# EAGLE design Actuator-MKI-Revision-DT (EAGLE 9.6.2)

## Sheet 1 of 2: Part Schematics
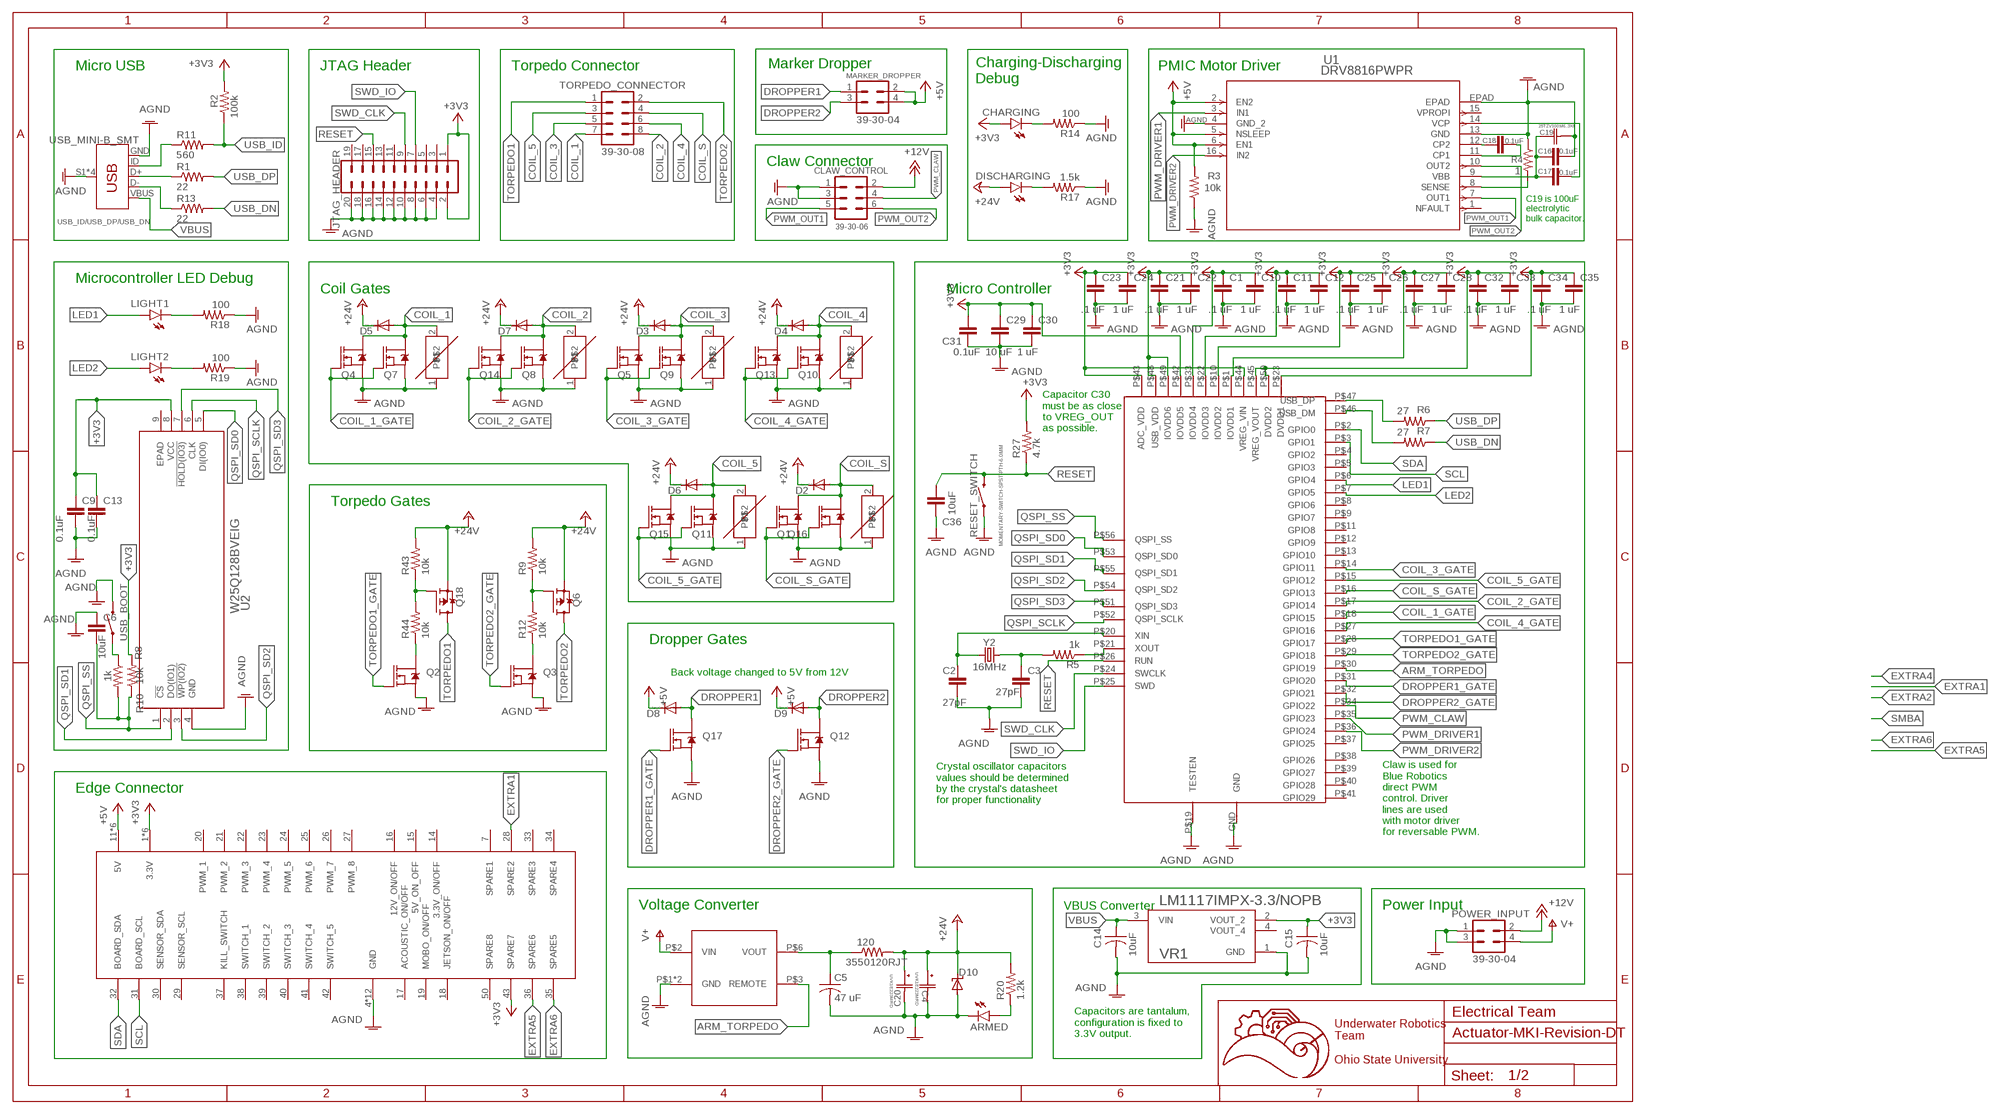
[diagram p0: schematic, sheet 1]

### Parts
120  3550120RJT  [3550120RJT]
ARMED  LEDCHIPLED_0603  [CHIPLED_0603]
C1  .1 uF  C-EUC0603  [C0603]
C2  27pF  C-EUC0603  [C0603]
C3  27pF  C-EUC0603  [C0603]
C4  UVK1E223MRD  [CAP_UFW_25X50_NCH]
C5  47 uF  C-USC1206K  [C1206K]
C6  10uF  C-EUC0603  [C0603]
C9  0.1uF  C-EUC0603  [C0603]
C10  1 uF  C-EUC0603  [C0603]
C11  .1 uF  C-EUC0603  [C0603]
C12  1 uF  C-EUC0603  [C0603]
C13  0.1uF  C-EUC0603  [C0603]
C14  10uF  C-USC0603  [C0603]
C15  10uF  C-USC0603  [C0603]
C16  0.1uF  C-EUC0603  [C0603]
C17  0.1uF  C-EUC0603  [C0603]
C18  0.1uF  C-EUC0603  [C0603]
C19  25TZV100M6.3X8  [CAP_J-V_6P3X8_RUB]
C20  UVK1E223MRD  [CAP_UFW_25X50_NCH]
C21  .1 uF  C-EUC0603  [C0603]
C22  1 uF  C-EUC0603  [C0603]
C23  .1 uF  C-EUC0603  [C0603]
C24  1 uF  C-EUC0603  [C0603]
C25  .1 uF  C-EUC0603  [C0603]
C26  1 uF  C-EUC0603  [C0603]
C27  .1 uF  C-EUC0603  [C0603]
C28  1 uF  C-EUC0603  [C0603]
C29  10 uF  C-EUC0603  [C0603]
C30  1 uF  C-EUC0603  [C0603]
C31  0.1uF  C-EUC0603  [C0603]
C32  .1 uF  C-EUC0603  [C0603]
C33  1 uF  C-EUC0603  [C0603]
C34  .1 uF  C-EUC0603  [C0603]
C35  1 uF  C-EUC0603  [C0603]
C36  10uF  C-EUC0603  [C0603]
CHARGING  LEDCHIPLED_0603  [CHIPLED_0603]
CLAW_CONTROL  39-30-06  [39-30-?06?]
D2  DIODE-SMB  [SMB]
D3  DIODE-SMB  [SMB]
D4  DIODE-SMB  [SMB]
D5  DIODE-SMB  [SMB]
D6  DIODE-SMB  [SMB]
D7  DIODE-SMB  [SMB]
D8  DIODE-SMB  [SMB]
D9  DIODE-SMB  [SMB]
D10  SUPPRESSOR-SMBJ  [SMBJ]
DISCHARGING  LEDCHIPLED_0603  [CHIPLED_0603]
JTAG_HEADER  CONN_10X2  [2X10]
LIGHT1  LEDCHIPLED_0603  [CHIPLED_0603]
LIGHT2  LEDCHIPLED_0603  [CHIPLED_0603]
MARKER_DROPPER  39-30-04  [39-30-?04?]
POWER_INPUT  39-30-04  [39-30-?04?]
Q1  MOSFET-NCH-AO3404A  [SOT23-3]
Q2  MOSFET-NCH-AO3404A  [SOT23-3]
Q3  MOSFET-NCH-AO3404A  [SOT23-3]
Q4  MOSFET-NCH-AO3404A  [SOT23-3]
Q5  MOSFET-NCH-AO3404A  [SOT23-3]
Q6  FDD4141TO252  [TO252]
Q7  MOSFET-NCH-AO3404A  [SOT23-3]
Q8  MOSFET-NCH-AO3404A  [SOT23-3]
Q9  MOSFET-NCH-AO3404A  [SOT23-3]
Q10  MOSFET-NCH-AO3404A  [SOT23-3]
Q11  MOSFET-NCH-AO3404A  [SOT23-3]
Q12  MOSFET-NCH-AO3404A  [SOT23-3]
Q13  MOSFET-NCH-AO3404A  [SOT23-3]
Q14  MOSFET-NCH-AO3404A  [SOT23-3]
Q15  MOSFET-NCH-AO3404A  [SOT23-3]
Q16  MOSFET-NCH-AO3404A  [SOT23-3]
Q17  MOSFET-NCH-AO3404A  [SOT23-3]
Q18  FDD4141TO252  [TO252]
R1  22  R-US_R0603  [R0603]
R2  100k  R-US_R0603  [R0603]
R3  10k  R-US_R0603  [R0603]
R4  1  R-US_R0805  [R0805]
R5  1k  R-US_R0603  [R0603]
R6  27  R-US_R0603  [R0603]
R7  27  R-US_R0603  [R0603]
R8  10k  R-US_R0603  [R0603]
R9  10k  R-US_R0603  [R0603]
R10  1k  R-US_R0603  [R0603]
R11  560  R-US_R0603  [R0603]
R12  10k  R-US_R0603  [R0603]
R13  22  R-US_R0603  [R0603]
R14  100  R-US_R0805  [R0805]
R17  1.5k  R-US_R0805  [R0805]
R18  100  R-US_R0805  [R0805]
R19  100  R-US_R0805  [R0805]
R20  1.2k  R-US_R0805  [R0805]
R27  4.7k  R-US_R0603  [R0603]
R43  10k  R-US_R0603  [R0603]
R44  10k  R-US_R0603  [R0603]
RESET_SWITCH  MOMENTARY-SWITCH-SPST-PTH-6.0MM  [TACTILE_SWITCH_PTH_6.0MM]
TORPEDO_CONNECTOR  39-30-08  [39-30-?08?]
U1  DRV8816PWPR  [PWP_16]
U2  W25Q128BVEIG  [WIN_E-8_WIN]
U$1  5530843-EDGE  [5530843-6-BOARDFINGERS]
U$2  ERZ-VF2M270ERZ-VF2M270  [RESM8060X320N]
U$3  ERZ-VF2M270ERZ-VF2M270  [RESM8060X320N]
U$4  ERZ-VF2M270ERZ-VF2M270  [RESM8060X320N]
U$5  ERZ-VF2M270ERZ-VF2M270  [RESM8060X320N]
U$6  TMR6-2415  [TMR6-2415]
U$7  ERZ-VF2M270ERZ-VF2M270  [RESM8060X320N]
U$8  ERZ-VF2M270ERZ-VF2M270  [RESM8060X320N]
U$9  RP2040  [RP2040]
USB_BOOT  MOMENTARY-SWITCH-SPST-PTH-6.0MM  [TACTILE_SWITCH_PTH_6.0MM]
USB_ID/USB_DP/USB_DN  USB_MINI-B_SMT  [USB-MINIB]
VR1  LM1117IMPX-3.3/NOPB  [VREG_LM1117IMPX-3.3/NOPB]
Y2  16MHz  CRYSTAL-16MHZPTH-HC49US  [HC49US]

### Nets
+3V3: C1.1 C9.1 C10.1 C11.1 C12.1 C13.1 C15.1 C21.1 C22.1 C23.1 C24.1 C25.1 C26.1 C27.1 C28.1 C29.1 C30.1 C31.2 C32.1 C33.1 C34.1 C35.1 CHARGING.A JTAG_HEADER.1 JTAG_HEADER.2 R2.2 R8.2 R27.2 U2.8(VCC) U$1.1(3.3V) U$1.2(3.3V) U$1.3(3.3V) U$1.43(SPARE7) U$1.54(3.3V) U$1.55(3.3V) U$1.56(3.3V) U$9.P$1(IOVDD1) U$9.P$10(IOVDD2) U$9.P$22(IOVDD3) U$9.P$23(DVDD1) U$9.P$33(IOVDD4) U$9.P$42(IOVDD5) U$9.P$43(ADC_VDD) U$9.P$44(VREG_VIN) U$9.P$45(VREG_VOUT) U$9.P$48(USB_VDD) U$9.P$49(IOVDD6) U$9.P$50(DVDD2) VR1.2(VOUT_2)
+5V: D8.C D9.C MARKER_DROPPER.2 MARKER_DROPPER.4 R3.2 U1.2(EN2) U1.5(NSLEEP) U1.6(EN1) U$1.11(5V) U$1.12(5V) U$1.13(5V) U$1.44(5V) U$1.45(5V) U$1.46(5V)
+12V: CLAW_CONTROL.2 POWER_INPUT.2
+24V: 120.P$2 C4.1 C20.1 D2.C D3.C D4.C D5.C D6.C D7.C D10.C DISCHARGING.A Q6.2(S) Q18.2(S) R9.2 R20.2 R43.2
AGND: ARMED.C C1.2 C2.2 C3.2 C4.2 C5.2 C6.1 C9.2 C10.2 C11.2 C12.2 C13.2 C14.2 C15.2 C16.2 C19.2 C20.2 C21.2 C22.2 C23.2 C24.2 C25.2 C26.2 C27.2 C28.2 C29.2 C30.2 C31.1 C32.2 C33.2 C34.2 C35.2 C36.1 CLAW_CONTROL.1 CLAW_CONTROL.3 D10.A JTAG_HEADER.4 JTAG_HEADER.6 JTAG_HEADER.8 JTAG_HEADER.10 JTAG_HEADER.12 JTAG_HEADER.14 JTAG_HEADER.16 JTAG_HEADER.18 JTAG_HEADER.20 POWER_INPUT.1 POWER_INPUT.3 Q1.2(S) Q2.2(S) Q3.2(S) Q4.2(S) Q5.2(S) Q7.2(S) Q8.2(S) Q9.2(S) Q10.2(S) Q11.2(S) Q12.2(S) Q13.2(S) Q14.2(S) Q15.2(S) Q16.2(S) Q17.2(S) R3.1 R4.1 R14.1 R17.1 R18.1 R19.1 RESET_SWITCH.1 U1.4(GND_2) U1.13(GND) U1.EPAD U2.4(GND) U$1.4(GND) U$1.5(GND) U$1.6(GND) U$1.8(GND) U$1.9(GND) U$1.10(GND) U$1.47(GND) U$1.48(GND) U$1.49(GND) U$1.51(GND) U$1.52(GND) U$1.53(GND) U$2.1 U$3.1 U$4.1 U$5.1 U$6.P$1(GND) U$6.P$7(GND) U$7.1 U$8.1 U$9.GND U$9.P$19(TESTEN) USB_BOOT.3 USB_ID/USB_DP/USB_DN.GND USB_ID/USB_DP/USB_DN.S1(SHIELD) USB_ID/USB_DP/USB_DN.S2(SHIELD) USB_ID/USB_DP/USB_DN.S3(SHIELD) USB_ID/USB_DP/USB_DN.S4(SHIELD) VR1.1(GND)
ARM_TORPEDO: U$6.P$3(REMOTE) U$9.P$30(GPIO19)
COIL_1: D5.A Q4.3(D) Q7.3(D) TORPEDO_CONNECTOR.7 U$8.2
COIL_1_GATE: Q4.1(G) Q7.1(G) U$9.P$18(GPIO15)
COIL_2: D7.A Q8.3(D) Q14.3(D) TORPEDO_CONNECTOR.8 U$7.2
COIL_2_GATE: Q8.1(G) Q14.1(G) U$9.P$17(GPIO14)
COIL_3: D3.A Q5.3(D) Q9.3(D) TORPEDO_CONNECTOR.5 U$5.2
COIL_3_GATE: Q5.1(G) Q9.1(G) U$9.P$14(GPIO11)
COIL_4: D4.A Q10.3(D) Q13.3(D) TORPEDO_CONNECTOR.6 U$4.2
COIL_4_GATE: Q10.1(G) Q13.1(G) U$9.P$27(GPIO16)
COIL_5: D6.A Q11.3(D) Q15.3(D) TORPEDO_CONNECTOR.3 U$3.2
COIL_5_GATE: Q11.1(G) Q15.1(G) U$9.P$15(GPIO12)
COIL_S: D2.A Q1.3(D) Q16.3(D) TORPEDO_CONNECTOR.4 U$2.2
COIL_S_GATE: Q1.1(G) Q16.1(G) U$9.P$16(GPIO13)
DROPPER1: D8.A MARKER_DROPPER.1 Q17.3(D)
DROPPER1_GATE: Q17.1(G) U$9.P$31(GPIO20)
DROPPER2: D9.A MARKER_DROPPER.3 Q12.3(D)
DROPPER2_GATE: Q12.1(G) U$9.P$32(GPIO21)
EXTRA1: U$1.28(SPARE2)
EXTRA5: U$1.36(SPARE6)
EXTRA6: U$1.35(SPARE5)
LED1: LIGHT1.A U$9.P$6(GPIO4)
LED2: LIGHT2.A U$9.P$7(GPIO5)
N$2: C3.1 R5.2 Y2.2
N$3: R5.1 U$9.P$21(XOUT)
N$4: CHARGING.C R14.2
N$6: R11.1 USB_ID/USB_DP/USB_DN.ID
N$7: R1.1 USB_ID/USB_DP/USB_DN.D+
N$8: R13.1 USB_ID/USB_DP/USB_DN.D-
N$10: ARMED.A R20.1
N$11: C2.1 U$9.P$20(XIN) Y2.1
N$12: R6.2 U$9.P$47(USB_DP)
N$15: DISCHARGING.C R17.2
N$16: LIGHT1.C R18.2
N$17: LIGHT2.C R19.2
N$18: R10.1 USB_BOOT.1
N$26: 120.P$1 C5.1 U$6.P$6(VOUT)
N$29: R7.2 U$9.P$46(USB_DM)
N$33: Q18.1(G) R43.1 R44.2
N$34: Q2.3(D) R44.1
N$35: Q6.1(G) R9.1 R12.2
N$36: Q3.3(D) R12.1
N$45: R4.2 U1.8(SENSE)
N$46: C17.2 U1.14(VCP)
N$47: C16.1 C17.1 C19.1 U1.9(VBB)
N$48: C18.2 U1.11(CP1)
N$49: C18.1 U1.12(CP2)
PWM_CLAW: CLAW_CONTROL.4 U$9.P$34(GPIO22)
PWM_DRIVER1: U1.3(IN1) U$9.P$35(GPIO23)
PWM_DRIVER2: U1.16(IN2) U$9.P$36(GPIO24)
PWM_OUT1: CLAW_CONTROL.5 U1.7(OUT1)
PWM_OUT2: CLAW_CONTROL.6 U1.10(OUT2)
QSPI_SCLK: U2.6(CLK) U$9.P$52(QSPI_SCLK)
QSPI_SD0: U2.5(DI(IO0)) U$9.P$53(QSPI_SD0)
QSPI_SD1: U2.2(DO(IO1)) U$9.P$55(QSPI_SD1)
QSPI_SD2: U2.3(!WP(IO2)) U$9.P$54(QSPI_SD2)
QSPI_SD3: U2.7(!HOLD(IO3)) U$9.P$51(QSPI_SD3)
QSPI_SS: C6.2 R8.1 R10.2 U2.1(!CS) U$9.P$56(QSPI_SS)
RESET: C36.2 JTAG_HEADER.15 R27.1 RESET_SWITCH.3 U$9.P$26(RUN)
SCL: U$1.31(BOARD_SCL) U$9.P$3(GPIO1)
SDA: U$1.32(BOARD_SDA) U$9.P$2(GPIO0)
SWD_CLK: JTAG_HEADER.9 U$9.P$24(SWCLK)
SWD_IO: JTAG_HEADER.7 U$9.P$25(SWD)
TORPEDO1: Q18.3(D) TORPEDO_CONNECTOR.1
TORPEDO1_GATE: Q2.1(G) U$9.P$28(GPIO17)
TORPEDO2: Q6.3(D) TORPEDO_CONNECTOR.2
TORPEDO2_GATE: Q3.1(G) U$9.P$29(GPIO18)
USB_DN: R7.1 R13.2
USB_DP: R1.2 R6.1
USB_ID: R2.1 R11.2
V+: POWER_INPUT.4 U$6.P$2(VIN)
VBUS: C14.1 USB_ID/USB_DP/USB_DN.VBUS VR1.3(VIN)
Unconnected: JTAG_HEADER.3 JTAG_HEADER.5 JTAG_HEADER.11 JTAG_HEADER.13 JTAG_HEADER.17 JTAG_HEADER.19 U1.1(NFAULT) U1.15(VPROPI) U2.9(EPAD) U$1.7(SPARE1) U$1.14(3.3V_ON/OFF) U$1.15(5V_ON_OFF) U$1.16(12V_ON/OFF) U$1.17(ACOUSTIC_ON/OFF) U$1.18(JETSON_ON/OFF) U$1.19(MOBO_ON/OFF) U$1.20(PWM_1) U$1.21(PWM_2) U$1.22(PWM_3) U$1.23(PWM_4) U$1.24(PWM_5) U$1.25(PWM_6) U$1.26(PWM_7) U$1.27(PWM_8) U$1.29(SENSOR_SCL) U$1.30(SENSOR_SDA) U$1.33(SPARE3) U$1.34(SPARE4) U$1.37(KILL_SWITCH) U$1.38(SWITCH_1) U$1.39(SWITCH_2) U$1.40(SWITCH_3) U$1.41(SWITCH_4) U$1.42(SWITCH_5) U$1.50(SPARE8) U$9.P$4(GPIO2) U$9.P$5(GPIO3) U$9.P$8(GPIO6) U$9.P$9(GPIO7) U$9.P$11(GPIO8) U$9.P$12(GPIO9) U$9.P$13(GPIO10) U$9.P$37(GPIO25) U$9.P$38(GPIO26) U$9.P$39(GPIO27) U$9.P$40(GPIO28) U$9.P$41(GPIO29) VR1.4(VOUT_4)

### Notes on the sheet
- Micro USB | JTAG Header | Torpedo Connector | Marker Dropper | PMIC Motor Driver
- Charging-Discharging 
  Debug
- Claw Connector
- C19 is 100uF
  electrolytic
  bulk capacitor.
- Microcontroller LED Debug
- Coil Gates | Micro Controller
- Capacitor C30 
  must be as close 
  to VREG_OUT
  as possible.
- Torpedo Gates
- Dropper Gates
- Back voltage changed to 5V from 12V
- Edge Connector
- Crystal oscillator capacitors
  values should be determined
  by the crystal's datasheet
  for proper functionality
- Claw is used for
  Blue Robotics
  direct PWM
  control. Driver
  lines are used
  with motor driver
  for reversable PWM.
- Voltage Converter | VBUS Converter | Power Input
- Electrical Team
- Capacitors are tantalum, 
  configuration is fixed to 
  3.3V output.
- Underwater Robotics
  Team
  
  Ohio State University

## Sheet 2 of 2: Notes
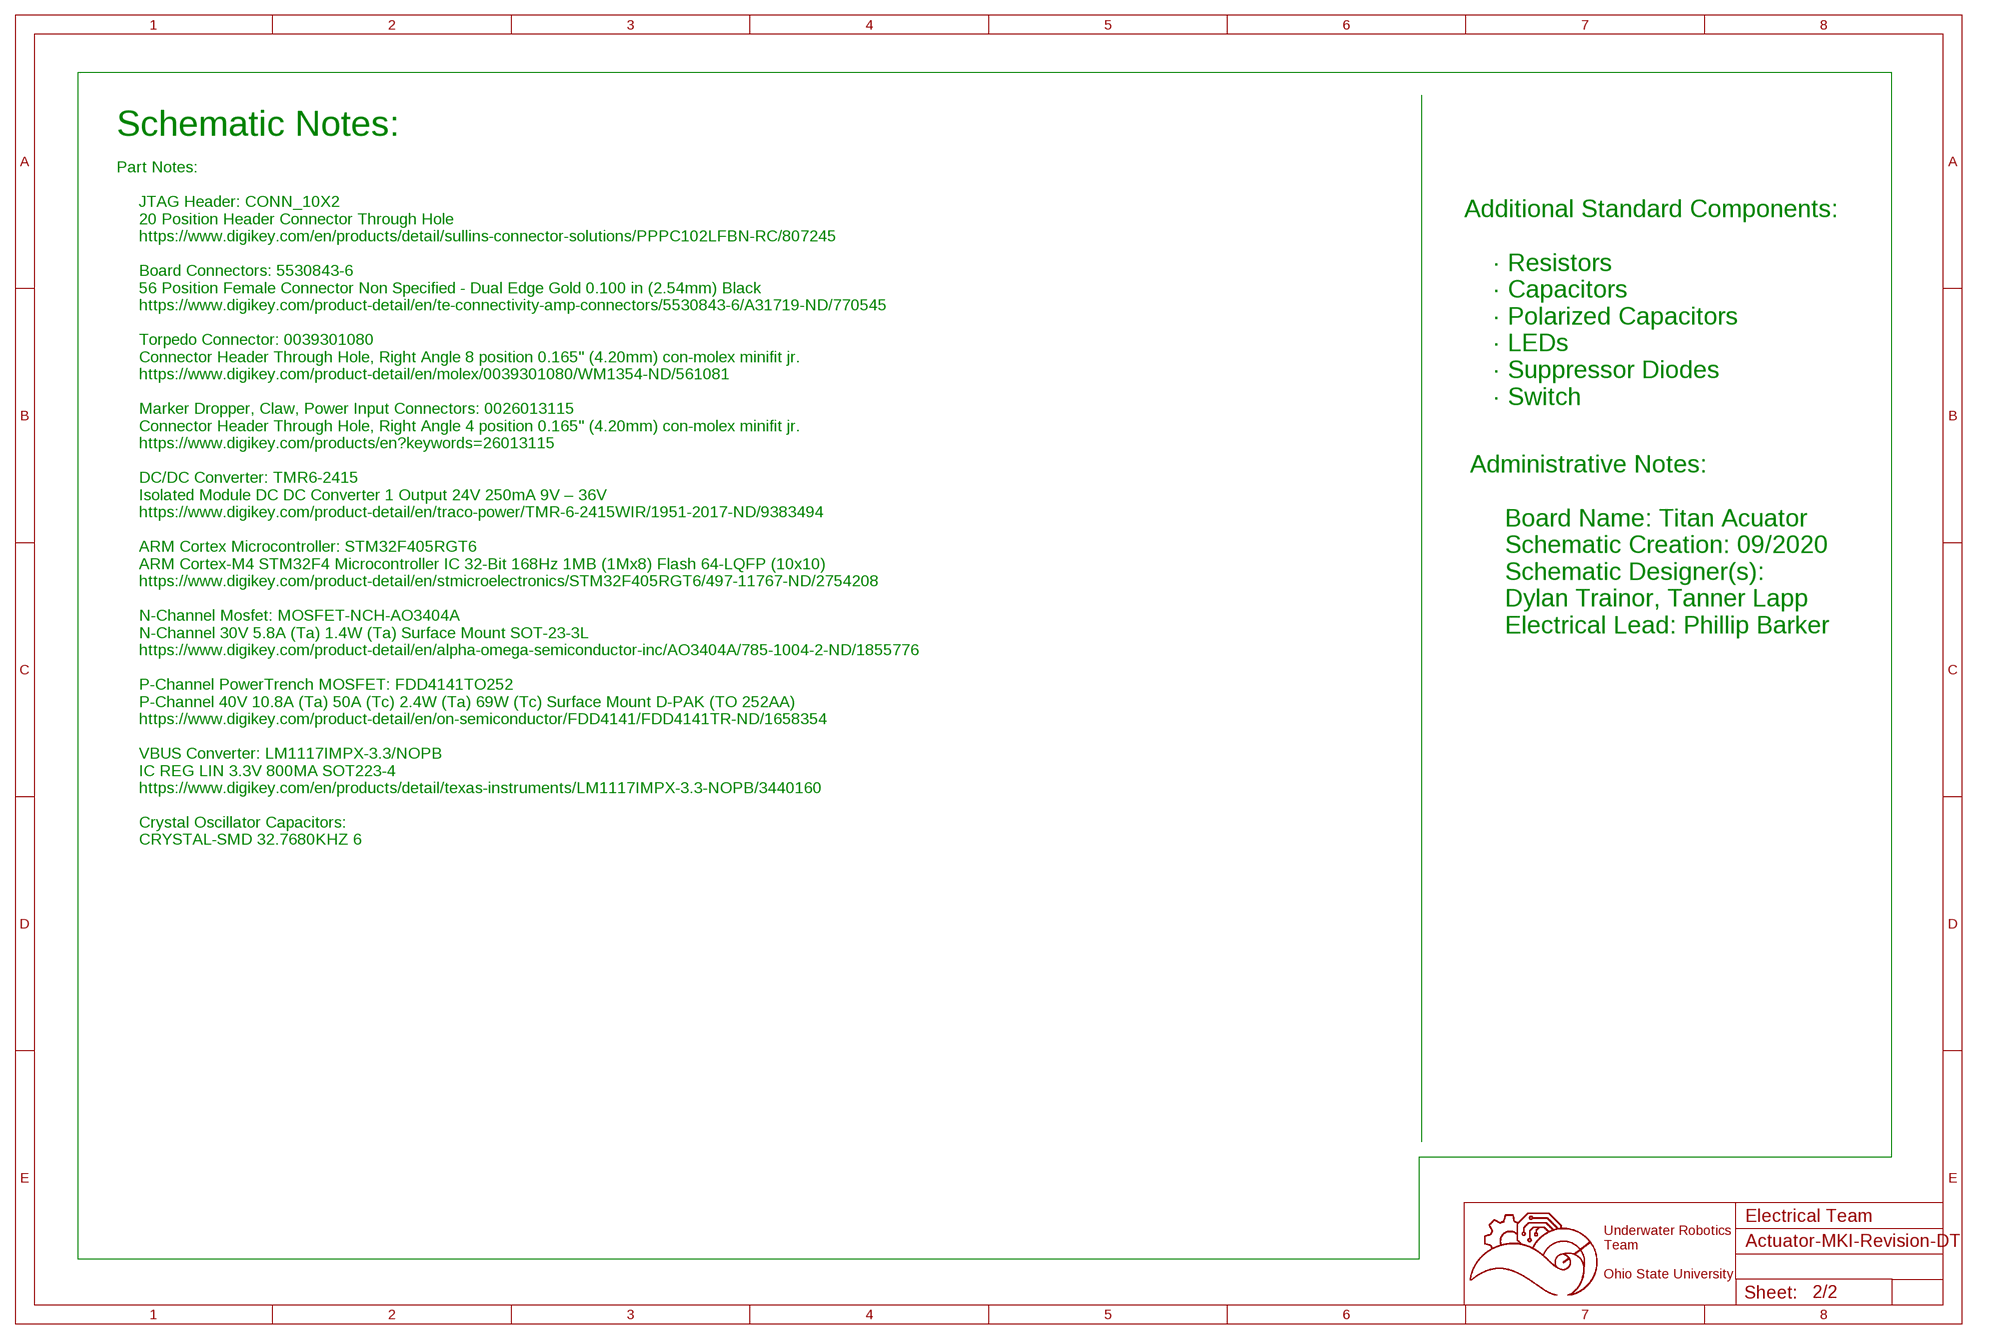
[diagram p1: schematic, sheet 2]

### Notes on the sheet
- Schematic Notes:
- Part Notes:
  
       JTAG Header: CONN_10X2
       20 Position Header Connector Through Hole 
       https://www.digikey.com/en/products/detail/sullins-connector-solutions/PPPC102LFBN-RC/807245
    
       Board Connectors: 5530843-6 
       56 Position Female Connector Non Specified - Dual Edge Gold 0.100 in (2.54mm) Black 
       https://www.digikey.com/product-detail/en/te-connectivity-amp-connectors/5530843-6/A31719-ND/770545 
    
       Torpedo Connector: 0039301080 
       Connector Header Through Hole, Right Angle 8 position 0.165" (4.20mm) con-molex minifit jr. 
       https://www.digikey.com/product-detail/en/molex/0039301080/WM1354-ND/561081 
    
       Marker Dropper, Claw, Power Input Connectors: 0026013115 
       Connector Header Through Hole, Right Angle 4 position 0.165" (4.20mm) con-molex minifit jr. 
       https://www.digikey.com/products/en?keywords=26013115 
    
       DC/DC Converter: TMR6-2415 
       Isolated Module DC DC Converter 1 Output 24V 250mA 9V – 36V 
       https://www.digikey.com/product-detail/en/traco-power/TMR-6-2415WIR/1951-2017-ND/9383494 
    
       ARM Cortex Microcontroller: STM32F405RGT6 
       ARM Cortex-M4 STM32F4 Microcontroller IC 32-Bit 168Hz 1MB (1Mx8) Flash 64-LQFP (10x10) 
       https://www.digikey.com/product-detail/en/stmicroelectronics/STM32F405RGT6/497-11767-ND/2754208 
    
       N-Channel Mosfet: MOSFET-NCH-AO3404A 
       N-Channel 30V 5.8A (Ta) 1.4W (Ta) Surface Mount SOT-23-3L 
       https://www.digikey.com/product-detail/en/alpha-omega-semiconductor-inc/AO3404A/785-1004-2-ND/1855776 
    
       P-Channel PowerTrench MOSFET: FDD4141TO252 
       P-Channel 40V 10.8A (Ta) 50A (Tc) 2.4W (Ta) 69W (Tc) Surface Mount D-PAK (TO 252AA) 
       https://www.digikey.com/product-detail/en/on-semiconductor/FDD4141/FDD4141TR-ND/1658354
  
       VBUS Converter: LM1117IMPX-3.3/NOPB
       IC REG LIN 3.3V 800MA SOT223-4
       https://www.digikey.com/en/products/detail/texas-instruments/LM1117IMPX-3.3-NOPB/3440160
    
       Crystal Oscillator Capacitors: 
       CRYSTAL-SMD 32.7680KHZ 6PF  3.2X1.5MM 
       https://www.digikey.com/en/products/detail/micro-crystal-ag/CM7V-T1A-32-768KHZ-6PF-20PPM-TA-QC/10499118
       CRYSTAL-16MHZPTH-HC49US (CRYSTAL-16MHZ)
       https://www.digikey.com/en/products/detail/abracon-llc/ABM3B-16-000MHZ-B2-T/675317?s=N4IgTCBcDaIKwGY4FoCcBGMZnuQOQBEQBdAXyA 
  
       ERZ-VF2M270 Varistor
       VARISTOR 27V 125A 2SMD JLEAD
       https://www.digikey.com/en/products/detail/panasonic-electronic-components/ERZ-VF2M270/672899
  
       3550120RJT Resistor
       RES 3550 120 Ohm 5% 5W
       https://www.digikey.com/en/products/detail/te-connectivity-passive-product/3550120RJT/9927251
  
       DRV8816PWPR Motor Driver
       IC MOTOR DRIVER 8V-38V 16HTSSOP
       https://www.digikey.com/en/products/detail/texas-instruments/DRV8816PWPR/4439658
  
       25TZV100M6.3X8 Electrolytic Capacitor
       CAP ALUM 100UF 20% 25V SMD
       https://www.digikey.com/en/products/detail/rubycon/25TZV100M6-3X8/3134865
  
       UVK1E223MRD 22mF Capacitor
       CAP ALUM 22000UF 20% 25V RADIAL
       https://www.digikey.com/en/products/detail/nichicon/UVK1E223MRD/2539394
- Additional Standard Components:
  
       · Resistors 
       · Capacitors 
       · Polarized Capacitors 
       · LEDs 
       · Suppressor Diodes 
       · Switch
- Administrative Notes:
  
       Board Name: Titan Acuator
       Schematic Creation: 09/2020
       Schematic Designer(s): 
       Dylan Trainor, Tanner Lapp
       Electrical Lead: Phillip Barker
- Electrical Team
- Underwater Robotics
  Team
  
  Ohio State University

## Library data of the parts
120 = 3550120RJT:3550120RJT
ARMED CHARGING DISCHARGING LIGHT1 LIGHT2 = led:LED: LED OSRAM: - CHIPLED LG R971, LG N971, LY N971, LG Q971, LY Q971, LO R971, LY R971 LH N974, LH R974 LS Q976, LO Q976, LY Q976 LO Q996 - Hyper CHIPLED LW Q18S LB Q993, LB Q99A, LB R99A - SideLED LS A670, LO A670, LY A670, LG A670, LP A670 LB A673, LV A673, LT A673, LW A673 LH A674 LY A675 LS A676, LA A676, LO A676, LY A676, LW A676 LS A679, LY A679, LG A679 - Hyper Micro SIDELED® LS Y876, LA Y876, LO Y876, LY Y876 LT Y87S - SmartLED LW L88C, LW L88S LB L89C, LB L89S, LG L890 LS L89K, LO L89K, LY L89K LS L896, LA L896, LO L896, LY L896 - TOPLED LS T670, LO T670, LY T670, LG T670, LP T670 LSG T670, LSP T670, LSY T670, LOP T670, LYG T670 LG T671, LOG T671, LSG T671 LB T673, LV T673, LT T673, LW T673 LH T674 LS T676, LA T676, LO T676, LY T676, LB T676, LH T676, LSB T676, LW T676 LB T67C, LV T67C, LT T67C, LS T67K, LO T67K, LY T67K, LW E67C LS E67B, LA E67B, LO E67B, LY E67B, LB E67C, LV E67C, LT E67C LW T67C LS T679, LY T679, LG T679 LS T770, LO T770, LY T770, LG T770, LP T770 LB T773, LV T773, LT T773, LW T773 LH T774 LS E675, LA E675, LY E675, LS T675 LS T776, LA T776, LO T776, LY T776, LB T776 LHGB T686 LT T68C, LB T68C - Hyper Mini TOPLED® LB M676 - Mini TOPLED Santana® LG M470 LS M47K, LO M47K, LY M47K Source: http://www.osram.convergy.de LUXEON: - LUMILED® LXK2-PW12-R00, LXK2-PW12-S00, LXK2-PW14-U00, LXK2-PW14-V00 LXK2-PM12-R00, LXK2-PM12-S00, LXK2-PM14-U00 LXK2-PE12-Q00, LXK2-PE12-R00, LXK2-PE12-S00, LXK2-PE14-T00, LXK2-PE14-U00 LXK2-PB12-K00, LXK2-PB12-L00, LXK2-PB12-M00, LXK2-PB14-N00, LXK2-PB14-P00, LXK2-PB14-Q00 LXK2-PR12-L00, LXK2-PR12-M00, LXK2-PR14-Q00, LXK2-PR14-R00 LXK2-PD12-Q00, LXK2-PD12-R00, LXK2-PD12-S00 LXK2-PH12-R00, LXK2-PH12-S00 LXK2-PL12-P00, LXK2-PL12-Q00, LXK2-PL12-R00 Source: www.luxeon.com KINGBRIGHT: KA-3528ASYC Source: www.kingbright.com
C1-C3 C6 C9-C13 C16-C18 C21-C36 = rcl:C-EU: CAPACITOR, European symbol; SPICEPREFIX: C
C4 C20 = UVK1E223MRD:UVK1E223MRD; BUILT_BY: EMA_Cory; COPYRIGHT: Copyright (C) 2018 Accelerated Designs. All rights reserved; MANUFACTURER_PART_NUMBER: UVK1E223MRD; SOURCELIBRARY: Nichicon_2019-09-13; VENDOR: Nichicon
C5 = resistor:C-US: CAPACITOR, American symbol
C14 C15 = rcl:C-US: CAPACITOR, American symbol; SPICEPREFIX: C
C19 = 25TZV100M6_3X8:25TZV100M6.3X8; BUILT_BY: EMA_Cory; COPYRIGHT: Copyright (C) 2018 Accelerated Designs. All rights reserved; MANUFACTURER_PART_NUMBER: 25TZV100M6.3X8; SOURCELIBRARY: Rubycon_2019-09-19; VENDOR: Rubycon Netherlands
CLAW_CONTROL = con-molex-mini-fit:39-30-?06?: HEADER
D2-D9 = diode:DIODE-: DIODE
D10 = diode:SUPPRESSOR-: Suppressor diode
JTAG_HEADER = SparkFun-Connectors:CONN_10X2: Multi connection point. Often used as Generic Header-pin footprint for 0.1 inch spaced/style header connections On any of the 0.1 inch spaced packages, you can populate with these: Break Away Headers - Straight <https://www.sparkfun.com/products/116> (PRT-00116) Break Away Male Headers - Right Angle <https://www.sparkfun.com/products/553> (PRT-00553) Female Headers <https://www.sparkfun.com/products/115> (PRT-00115) Break Away Headers - Machine Pin <https://www.sparkfun.com/products/117> (PRT-00117) Break Away Female Headers - Swiss Machine Pin <https://www.sparkfun.com/products/743> (PRT-00743) Special note about the "SPECIAL" package: This was SPECIALLY designed to be used with our Graphic LCD Backpack. Be sure you want to use this! It is not only staggered on each line of header holes, but IT IS ALSO offset of the center point of the top and bottom lines by 5 mil. This causes the headers to lock into place on the "standard" footprint on the LCD screen. The extra squares on the tdocu layer are there simply to reference other pins (if you were to actually populate a longer header than ten long - this is what we do with the backpacks).
MARKER_DROPPER POWER_INPUT = con-molex-mini-fit:39-30-?04?: HEADER
Q1-Q5 Q7-Q17 = SparkFun-DiscreteSemi:MOSFET-NCH: N-channel MOSFETs Voltage controlled devices that allow control of high current outputs. SparkFun Products: SparkFun OpenScale <https://www.sparkfun.com/products/13261> SparkFun Digital Sandbox <https://www.sparkfun.com/products/12651> SparkFun Monster Moto Shield <https://www.sparkfun.com/products/10182> SparkFun MOSFET Power Controller <https://www.sparkfun.com/products/11214>; PROD_ID: TRANS-12988; VALUE: 5.8A/30V/35mΩ
Q6 Q18 = transistor-fet:FDD4141: P-Channel PowerTrench® MOSFET Source: FDD4141.pdf
R1 R2 R5-R7 R10 R11 R13 R27 = rcl:R-US_: RESISTOR, American symbol; SPICEPREFIX: R
R3 R4 R8 R9 R12 R14 R17-R20 R43 R44 = resistor:R-US_: RESISTOR, American symbol
RESET_SWITCH USB_BOOT = SparkFun-Switches:MOMENTARY-SWITCH-SPST: Momentary Switch (Pushbutton) - SPST Normally-open (NO) SPST momentary switches (buttons, pushbuttons). Variants PTH-12MM - 12mm square, through-hole Momentary Pushbutton Switch - 12mm Square <https://www.sparkfun.com/products/9190> (COM-09190) PTH-6.0MM, PTH-6.0MM-KIT - 6.0mm square, through-hole Mini Pushbutton Switch <https://www.sparkfun.com/products/97> (COM-00097) KIT package intended for soldering kit's - only one side of pads' copper is exposed. PTH-RIGHT-ANGLE-KIT - Right-angle, through-hole Right Angle Tactile Button <https://www.sparkfun.com/products/10791> - Used on SparkFun BigTime Watch Kit <https://www.sparkfun.com/products/11734> SMD-12MM - 12mm square, surface-mount Tactile Button - SMD (12mm) <https://www.sparkfun.com/products/12993> (COM-12993) Used on SparkFun PicoBoard <https://www.sparkfun.com/products/11888> SMD-4.5MM - 4.5mm Square Trackball Switch Used on SparkFun Blackberry Trackballer Breakout <https://www.sparkfun.com/products/13169> SMD-4.6MMX2.8MM - 4.60mm x 2.80mm, surface mount Used on SparkFun SAMD21 Mini Breakout <https://www.sparkfun.com/products/13664> SMD-5.2MM, SMD-5.2-REDUNDANT - 5.2mm square, surface-mount Mini Pushbutton Switch - SMD <https://www.sparkfun.com/products/8720> (COM-08720) Used on Arduino Pro Mini <https://www.sparkfun.com/products/11114> REDUNDANT package connects both switch circuits together SMD-6.0X3.5MM - 6.0 x 3.5mm, surface mount Momentary Reset Switch SMD <https://www.sparkfun.com/products/8229> (COM-08229) SMD-6.2MM-TALL - 6.2mm square, surface mount Tactile Button - SMD (6mm) <https://www.sparkfun.com/products/12992> Used on SparkFun Digital Sandbox <https://www.sparkfun.com/products/12651> SMD-RIGHT-ANGLE - Right-angle, surface mount Used on SparkFun Block for Intel® Edison - Arduino <https://www.sparkfun.com/products/13036>; PROD_ID: SWCH-08441; SF_SKU: COM-00097
TORPEDO_CONNECTOR = con-molex-mini-fit:39-30-?08?: HEADER
U1 = DRV8816POWPR:DRV8816PWPR; MANUFACTURER_PART_NUMBER: DRV8816PWPR; VENDOR: Texas Instruments
U2 = W25Q128JVSIQ:W25Q128BVEIG; COPYRIGHT: Copyright (C) 2021 Ultra Librarian. All rights reserved.; MANUFACTURER_PART_NUMBER: W25Q128BVEIG; MFR_NAME: Winbond
U$1 = 5530843-6:5530843-EDGE
U$2-U$5 U$7 U$8 = ERZ-VF2M270:ERZ-VF2M270
U$6 = converter:TMR6-2415
U$9 = RP2040:RP2040
USB_ID/USB_DP/USB_DN = SparkFun-Connectors:USB_MINI-B: USB type Mini-B Connector Breaks out 5th pin, and includes shield pins if needed. SparkFun Products: SparkFun FTDI Basic Breakout <https://www.sparkfun.com/products/9716> SparkFun XBee Explorer USB <https://www.sparkfun.com/products/11812> SparkFun Redboard <https://www.sparkfun.com/products/12757>; PROD_ID: CONN-08193; SF_ID: PRT-00587
VR1 = LM1117IMPX-3.3_NOPB:LM1117IMPX-3.3/NOPB: 800-mA 15-V linear voltage regulator 4-SOT-223 0 to 125 Check prices <https://pricing.snapeda.com/parts/LM1117IMPX-3.3/NOPB/Texas%20Instruments/view-part?ref=eda>; AVAILABILITY: Good; DESCRIPTION: 800-mA 15-V linear voltage regulator 4-SOT-223 -40 to 125; MF: Texas Instruments; MP: LM1117IMPX-3.3/NOPB; PACKAGE: SOT-223-4 Texas Instruments; PRICE: None; PURCHASE-URL: https://pricing.snapeda.com/search/part/LM1117IMPX-3.3/NOPB/?ref=eda
Y2 = SparkFun-Clocks:CRYSTAL-16MHZ: 16MHz Crystal Digikey Example <http://www.digikey.com/product-search/en?keywords=535-9122-1-ND> Frequency: 16MHz Frequency Stability: ±50ppm Frequency Tolerance: ±20ppm Load Capacitance: 18pF SparkFun Products: Pro Micro -5V/16MHz <https://www.sparkfun.com/products/12640> SparkFun Serial Enabled LCD Kit <https://www.sparkfun.com/products/10097>; PROD_ID: XTAL-08181; SF_ID: COM-00536

## Board
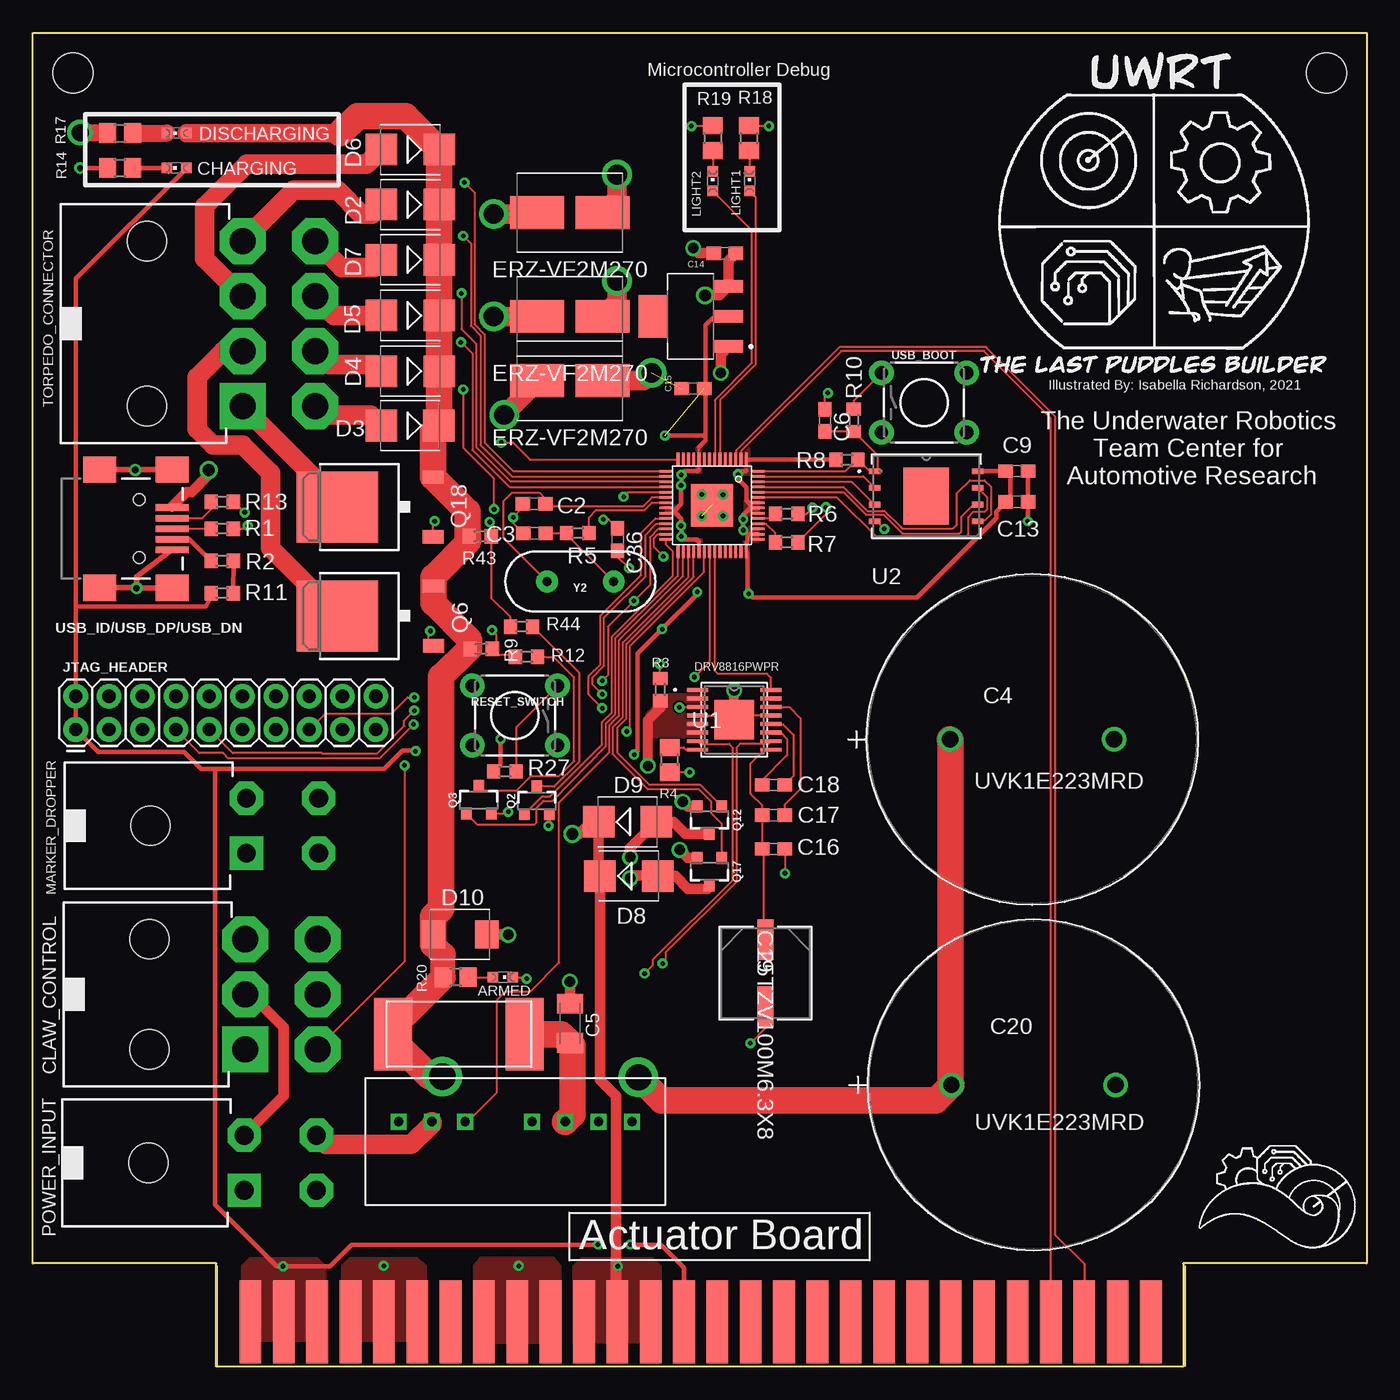
[diagram p2: board, top side]
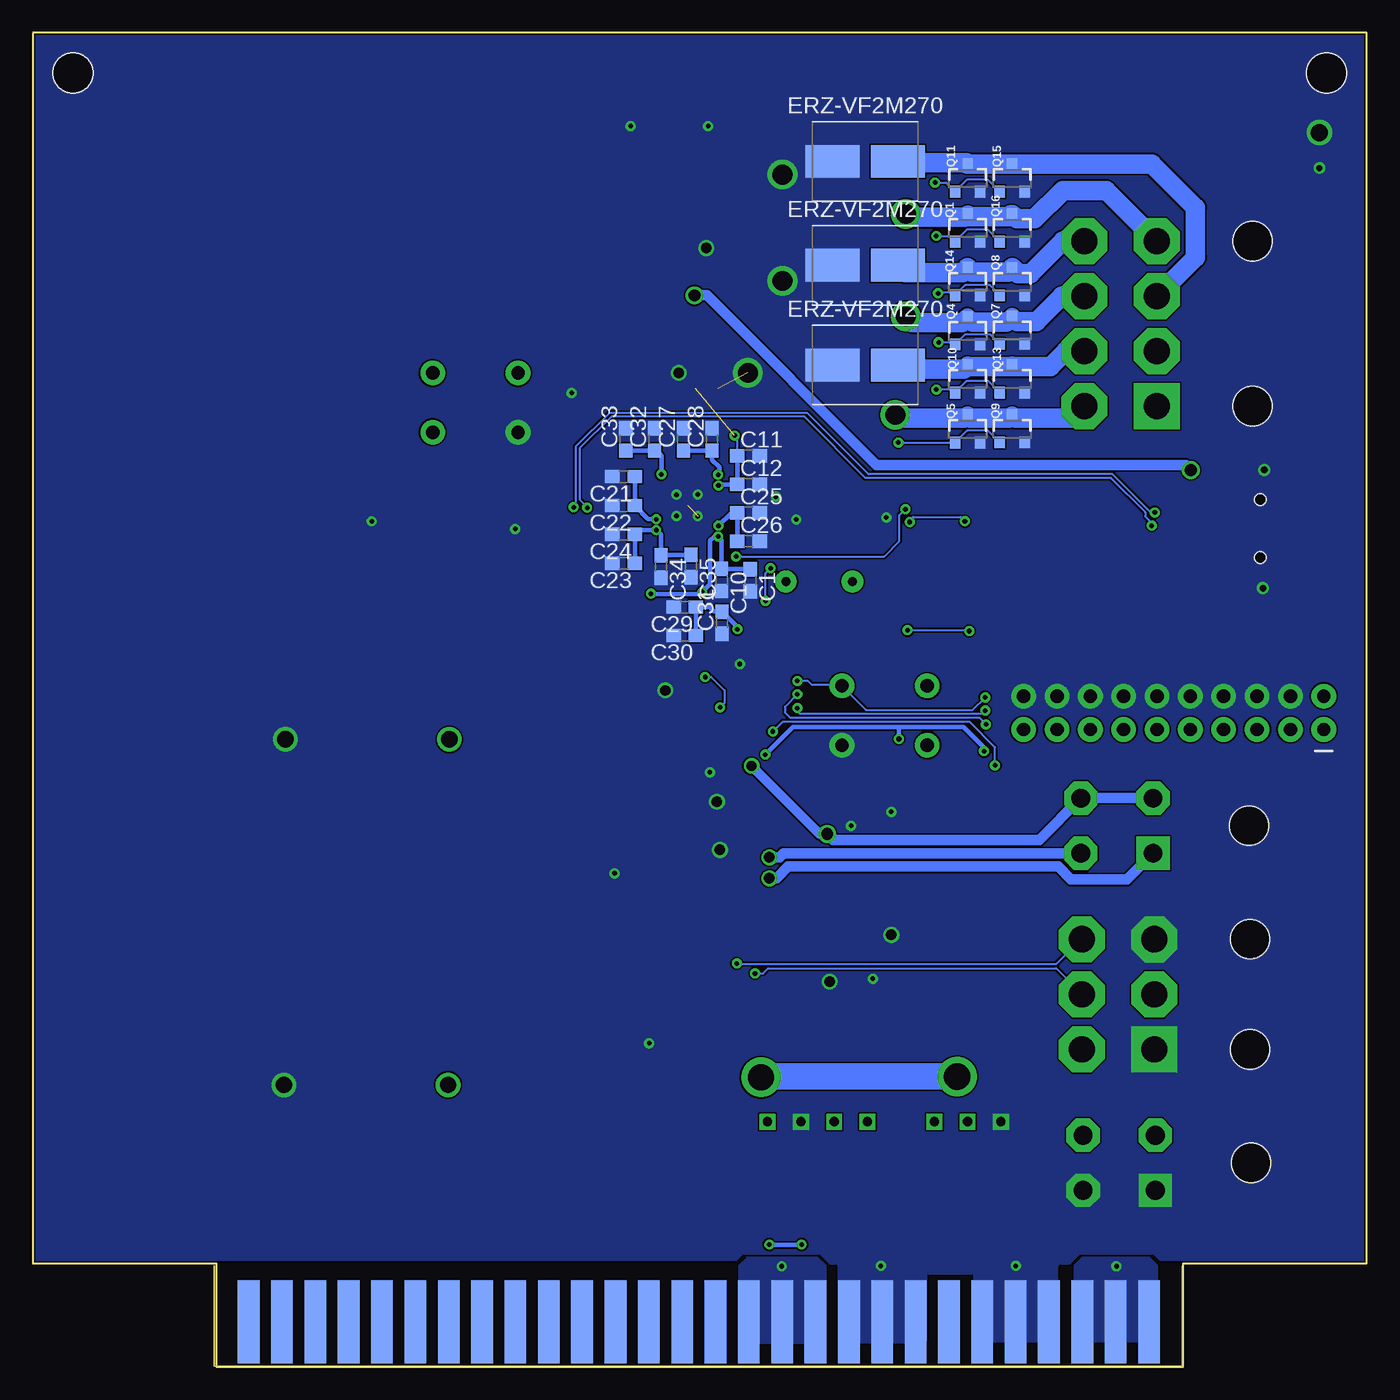
[diagram p3: board, bottom side, seen from below]

Size 101.6 x 101.6 mm. Coordinates in mm from the lower left corner, seen from the top.
Outline: 13.97,0 13.97,7.87 0,7.87 0,101.6 101.6,101.6 101.6,7.87 87.63,7.87 87.63,0 13.97,0
Copper layers (1*16): Top 0.035mm / dielectric 1.5mm / Bottom 0.035mm
Design rules "default *": minimum track width 6mil, minimum drill 0.35mm, track to track 5mil, track to pad 8mil, pad to pad 5mil, via to via 10mil, smd to smd 2mil, copper to edge 0mil, drill to drill 6mil, minimum pad ring 10mil, minimum via ring 8mil, stop-mask expansion 4mil, vias tented up to drill 0mil, thermal gap 10mil
Holes 3.05 mm at 3.05,98.55 98.55,98.55

### Footprints (pad centres in the part's own frame; a part is rotated, then mirrored left to right if it is on the bottom)
3550120RJT = smd 2.896 x 5.499: P$1 -5,0; P$2 5,0
CHIPLED_0603 = smd 0.8 x 0.8: A 0,-0.75; C 0,0.75
C0603 = smd 1.1 x 1: 1 -0.85,0; 2 0.85,0
CAP_UFW_25X50_NCH = drill 1.245 pad 1.753: 1 0,0; 2 12.497,0
C1206K = smd 1.5 x 2: 1 -1.5,0; 2 1.5,0
CAP_J-V_6P3X8_RUB = smd 3.099 x 1.219: 1 -2.553,0; 2 2.553,0
39-30-?06? = drill 2 pad 3.5 square: 1 4.191,0 | drill 2 pad 3.5 octagon: 2 0,0; 3 -4.191,0; 4 4.191,5.512; 5 0,5.512; 6 -4.191,5.512 | hole 3: -4.191,-7.3; 4.191,-7.3
SMB = smd 2.4 x 2.4: A 2.2,0; C -2.2,0
SMBJ = smd 1.78 x 2.16: A 2.04,0; C -2.03,0
2X10 = drill 1.016 pad 1.88: 1 0,0; 2 0,2.54; 3 2.54,0; 4 2.54,2.54; 5 5.08,0; 6 5.08,2.54; 7 7.62,0; 8 7.62,2.54; 9 10.16,0; 10 10.16,2.54; 11 12.7,0; 12 12.7,2.54; 13 15.24,0; 14 15.24,2.54; 15 17.78,0; 16 17.78,2.54; 17 20.32,0; 18 20.32,2.54; 19 22.86,0; 20 22.86,2.54
39-30-?04? = drill 1.422 pad 2.54 square: 1 2.095,0 | drill 1.422 pad 2.54 octagon: 2 -2.095,0; 3 2.095,5.512; 4 -2.095,5.512 | hole 3: 0,-7.3
SOT23-3 = smd 0.8 x 0.9: 1 -0.95,-1; 2 0.95,-1; 3 0,1.1
TO252 = smd 1 x 1.6: 1 -2.28,-4.8; 2 2.28,-4.8 | smd 5.4 x 6.2: 3 0,2.5
R0603 = smd 1 x 1.1: 1 -0.85,0; 2 0.85,0
R0805 = smd 1.3 x 1.5: 1 -0.95,0; 2 0.95,0
TACTILE_SWITCH_PTH_6.0MM = drill 1.016 pad 1.88: 1 -3.251,2.261; 2 3.251,2.261; 3 -3.251,-2.261; 4 3.251,-2.261
39-30-?08? = drill 2 pad 3.5 square: 1 6.287,0 | drill 2 pad 3.5 octagon: 2 2.095,0; 3 -2.095,0; 4 -6.287,0; 5 6.287,5.512; 6 2.095,5.512; 7 -2.095,5.512; 8 -6.287,5.512 | hole 3: -6.287,-7.3; 6.287,-7.3
PWP_16 = smd 1.6 x 0.3: 1 -2.8,2.275; 2 -2.8,1.625; 3 -2.8,0.975; 4 -2.8,0.325; 5 -2.8,-0.325; 6 -2.8,-0.975; 7 -2.8,-1.625; 8 -2.8,-2.275; 9 2.8,-2.275; 10 2.8,-1.625; 11 2.8,-0.975; 12 2.8,-0.325; 13 2.8,0.325; 14 2.8,0.975; 15 2.8,1.625; 16 2.8,2.275 | smd 3 x 3: EPAD 0,0
WIN_E-8_WIN = smd 0.864 x 0.432: 1 -3.924,1.905; 2 -3.924,0.635; 3 -3.924,-0.635; 4 -3.924,-1.905; 5 3.924,-1.905; 6 3.924,-0.635; 7 3.924,0.635; 8 3.924,1.905 | smd 3.454 x 4.343: 9 0,0
5530843-6-BOARDFINGERS = smd 1.651 x 6.35 bottom: 1 0.826,3.375; 2 3.365,3.375; 3 5.905,3.375; 4 8.445,3.375; 5 10.986,3.375; 6 13.525,3.375; 7 16.066,3.375; 8 18.605,3.375; 9 21.145,3.375; 10 23.686,3.375; 11 26.226,3.375; 12 28.765,3.375; 13 31.305,3.375; 14 33.846,3.375; 15 36.386,3.375; 16 38.925,3.375; 17 41.465,3.375; 18 44.005,3.375; 19 46.545,3.375; 20 49.086,3.375; 21 51.626,3.375; 22 54.166,3.375; 23 56.706,3.375; 24 59.245,3.375; 25 61.785,3.375; 26 64.326,3.375; 27 66.865,3.375; 28 69.406,3.375 | smd 1.651 x 6.35: 29 69.406,3.375; 30 66.865,3.375; 31 64.326,3.375; 32 61.785,3.375; 33 59.245,3.375; 34 56.706,3.375; 35 54.166,3.375; 36 51.626,3.375; 37 49.086,3.375; 38 46.545,3.375; 39 44.005,3.375; 40 41.465,3.375; 41 38.925,3.375; 42 36.386,3.375; 43 33.846,3.375; 44 31.305,3.375; 45 28.765,3.375; 46 26.226,3.375; 47 23.686,3.375; 48 21.145,3.375; 49 18.605,3.375; 50 16.066,3.375; 51 13.525,3.375; 52 10.986,3.375; 53 8.445,3.375; 54 5.905,3.375; 55 3.365,3.375; 56 0.826,3.375
RESM8060X320N = smd 4.11 x 2.5: 1 -2.495,0; 2 2.495,0
TMR6-2415 = drill 0.7 square: P$1 0,0; P$2 2.54,0; P$3 5.08,0; P$5 10.16,0; P$6 12.7,0; P$7 15.24,0; P$8 17.78,0
RP2040 = smd 3.2 x 3.2: GND 0,0 | smd 1 x 0.2: P$1 -3.5,2.6; P$2 -3.5,2.2; P$3 -3.5,1.8; P$4 -3.5,1.4; P$5 -3.5,1; P$6 -3.5,0.6; P$7 -3.5,0.2; P$8 -3.5,-0.2; P$9 -3.5,-0.6; P$10 -3.5,-1; P$11 -3.5,-1.4; P$12 -3.5,-1.8; P$13 -3.5,-2.2; P$14 -3.5,-2.6; P$29 3.5,-2.6; P$30 3.5,-2.2; P$31 3.5,-1.8; P$32 3.5,-1.4; P$33 3.5,-1; P$34 3.5,-0.6; P$35 3.5,-0.2; P$36 3.5,0.2; P$37 3.5,0.6; P$38 3.5,1; P$39 3.5,1.4; P$40 3.5,1.8; P$41 3.5,2.2; P$42 3.5,2.6 | smd 0.2 x 1: P$15 -2.6,-3.5; P$16 -2.2,-3.5; P$17 -1.8,-3.5; P$18 -1.4,-3.5; P$19 -1,-3.5; P$20 -0.6,-3.5; P$21 -0.2,-3.5; P$22 0.2,-3.5; P$23 0.6,-3.5; P$24 1,-3.5; P$25 1.4,-3.5; P$26 1.8,-3.5; P$27 2.2,-3.5; P$28 2.6,-3.5; P$43 2.6,3.5; P$44 2.2,3.5; P$45 1.8,3.5; P$46 1.4,3.5; P$47 1,3.5; P$48 0.6,3.5; P$49 0.2,3.5; P$50 -0.2,3.5; P$51 -0.6,3.5; P$52 -1,3.5; P$53 -1.4,3.5; P$54 -1.8,3.5; P$55 -2.2,3.5; P$56 -2.6,3.5
USB-MINIB = smd 2.5 x 0.5: D+ 2.5,0; D- 2.5,0.8; GND 2.5,-1.6; ID 2.5,-0.8; VBUS 2.5,1.6 | smd 2.5 x 2: S1 -3,4.5; S2 2.5,4.5; S3 -3,-4.5; S4 2.5,-4.5 | hole 0.9: 0,2.2; 0,-2.2
VREG_LM1117IMPX-3.3/NOPB = smd 2.15 x 0.95: 1 -2.9,2.3; 2 -2.9,0; 3 -2.9,-2.3 | smd 2.15 x 3.25: 4 2.9,0
HC49US = drill 0.7 pad 1.651: 1 -2.54,0; 2 2.54,0

### Placement (x,y rotation side)
120  32.46,25.33 180 top
ARMED  35.81,29.66 270 top
C1  46.95,59.9 270 bottom
C2  38.17,65.73 180 top
C3  38.2,63.48 180 top
C4  69.87,47.78 0 top
C5  40.92,26.16 90 top
C6  60.33,72.08 270 top
C9  74.96,68.22 0 top
C10  49.13,59.93 270 bottom
C11  47.09,69.38 0 bottom
C12  47.09,67.21 0 bottom
C13  74.96,65.87 0 top
C14  52.7,84.8 180 top
C15  50.28,74.5 180 top
C16  56.41,39.43 0 top
C17  56.41,42 0 top
C18  56.41,44.31 180 top
C19  55.8,29.98 270 top
C20  69.97,21.46 0 top
C21  56.6,67.79 180 bottom
C22  56.6,65.58 180 bottom
C23  56.6,61.2 180 bottom
C24  56.6,63.4 180 bottom
C25  47.09,65.04 0 bottom
C26  47.09,62.87 0 bottom
C27  52.05,70.63 90 bottom
C28  49.86,70.63 90 bottom
C29  51.94,57.85 180 bottom
C30  51.94,55.7 180 bottom
C31  49.1,56.66 90 bottom
C32  54.24,70.63 90 bottom
C33  56.43,70.63 90 bottom
C34  53.76,60.95 270 bottom
C35  51.48,60.99 270 bottom
C36  44.54,63 270 top
CHARGING  10.95,91.31 90 top
CLAW_CONTROL  39-30-06?  [39-30-?06?]  16.18,28.36 270 top
D2  28.76,88.51 180 top
D3  28.74,71.68 180 top
D4  28.76,75.82 180 top
D5  28.75,80.08 180 top
D6  28.76,92.71 180 top
D7  28.76,84.32 180 top
D8  45.4,37.36 0 top
D9  45.3,41.5 0 top
D10  32.53,32.93 0 top
DISCHARGING  10.95,93.96 90 top
JTAG_HEADER  3.27,48.53 0 top
LIGHT1  54.59,90.29 0 top
LIGHT2  51.79,90.29 0 top
MARKER_DROPPER  39-30-04?  [39-30-?04?]  16.26,41.2 270 top
POWER_INPUT  39-30-04?  [39-30-?04?]  16.1,15.53 270 top
Q1  30.4,86.7 0 bottom
Q2  38.39,43.09 0 top
Q3  33.96,43.14 0 top
Q4  30.4,78.87 0 bottom
Q5  30.4,71.39 0 bottom
Q6  25.71,57.19 90 top
Q7  27,78.9 0 bottom
Q8  27,82.6 0 bottom
Q9  27,71.4 0 bottom
Q10  30.4,75.2 0 bottom
Q11  30.4,90.5 0 bottom
Q12  51.54,41.68 180 top
Q13  27,75.21 0 bottom
Q14  30.4,82.61 0 bottom
Q15  27,90.5 0 bottom
Q16  27,86.7 0 bottom
Q17  51.54,37.74 180 top
Q18  25.7,65.49 90 top
R1  14.43,63.84 0 top
R2  14.43,58.92 180 top
R3  47.78,51.58 270 top
R4  48.51,46.23 90 top
R5  41.51,63.5 180 top
R6  57.42,64.96 180 top
R7  57.42,62.8 180 top
R8  62.01,69.08 180 top
R9  34.16,54.67 180 top
R10  62.54,72.08 270 top
R11  14.43,61.38 0 top
R12  37.6,54.07 180 top
R13  14.43,65.87 0 top
R14  6.64,91.31 0 top
R17  6.64,93.96 0 top
R18  54.54,93.58 270 top
R19  51.79,93.58 270 top
R20  32.22,29.67 180 top
R27  35.96,45.34 180 top
R43  34.07,63.24 180 top
R44  37.23,56.37 180 top
RESET_SWITCH  36.72,49.6 180 top
TORPEDO_CONNECTOR  39-30-08?  [39-30-?08?]  15.99,79.45 270 top
U1  53.43,49.27 0 top
U2  68.05,66.3 0 top
U$1  15.76,0.05 0 top
U$2  40.9,87.9 180 top
U$3  38.2,91.8 0 bottom
U$4  38.2,76.3 0 bottom
U$5  40.9,75.1 180 top
U$6  27.86,18.66 0 top
U$7  38.2,83.9 0 bottom
U$8  40.9,80 180 top
U$9  51.74,65.61 270 top
USB_BOOT  67.89,73.44 0 top
USB_ID/USB_DP/USB_DN  8.1,63.84 0 top
VR1  50.1,80 180 top
Y2  41.7,59.8 0 top

### Tracks (layer width: path | path; a pad name or v marks a point on that pad's centre or on a via)
+3V3  (via drill 0.35)  (1 unrouted)
  Top 0.152: 13.58,58.64 R2.2 | U$1.43 49.61,3.44 | VR1.2 53.9,80 | 54.32,62.13 U$9.P$42 54.45,62 | 50.75,68.32 50.75,70.03 | 51.2,70.93 51.24,70.89
  Top 0.35: 13.89,45.53 26.77,45.53 28.17,46.92 29.1,46.92 v29.14,46.88 | 13.89,45.53 12.84,45.53 11.54,46.83 4.97,46.83 JTAG_HEADER.1 JTAG_HEADER.2 | JTAG_HEADER.2 3.27,57.9 13.15,57.9 13.58,58.64 | 13.89,45.53 13.89,12.31 18.56,7.65 v19.06,7.65 22.65,7.65 24.3,9.3 v43.04,9.3 | 49.61,3.44 49.61,7.55 47.87,9.3 v45.5,9.3 | JTAG_HEADER.2 3.27,82.87 CHARGING.A | VR1.2 51.91,80 51.24,79.33 51.24,70.89 51.24,70.52 50.75,70.03 | v35.63,47.81 35.63,45.86 R27.2 | v45.8,46.62 45.83,46.62 46.06,46.85 46.06,54.32 47.92,56.17 v47.94,56.17 47.94,56.19 50.61,58.87 v50.61,59.01 | U2.8 74.09,68.21 C9.1 74.47,67.86 74.47,66.24 C13.1 73.38,65.15 73.38,64.62 67.34,58.58 54.81,58.58 v54.52,58.88 54.45,58.94 54.45,62 | 50.74,62.85 50.58,63.01 49.63,63.01 v49.4,63.24 49.4,64.03 v49.38,64.06 49.38,64.07 49.38,64.6 48.9,65.08 48.9,65.22 49.38,65.69 v49.38,67.13 49.4,67.15 v49.4,67.95 49.66,68.21 50.64,68.21 50.75,68.32 | 54.36,68.25 54.32,68.21 53.95,68.21 v53.72,67.98 53.72,67.61 54.36,66.97 54.36,65.95 54.65,65.67 54.65,65.41 | U$9.P$49 54.65,65.41 | 54.65,65.41 54.11,64.87 v54.11,64.55 v54.11,63.73 54.43,63.41 | 54.43,63.41 U$9.P$44 | 54.43,63.41 54.43,62.85 54.38,62.8 | R8.2 54.45,69.08 54.42,69.11 | v48.14,70.93 51.2,70.93
  Bottom 0.152: C11.1 47.94,70.72 v48.14,70.93
  Bottom 0.35: v45.5,9.3 v43.04,9.3 | v29.14,46.88 29.14,47.17 30.71,48.74 35.66,48.74 | 35.63,47.95 v35.63,47.81 35.63,48.7 35.66,48.74 | v45.8,46.62 43.69,48.74 35.66,48.74 | C21.1 C22.1 54.72,64.55 v54.11,64.55 | C21.1 | C23.1 C24.1 55.42,63.73 v54.11,63.73 53.76,63.38 C34.1 53.72,61.84 C35.1 | C1.1 49.1,60.75 C10.1 49.13,62.98 v49.4,63.24 49.7,63.24 50.02,62.92 50.02,59.6 v50.61,59.01 50.76,59.01 50.92,58.85 54.54,58.85 v54.52,58.88 | C11.1 C12.1 49.3,67.21 v49.38,67.13 | C26.1 C25.1 48.4,65.04 v49.38,64.06 | C33.1 C32.1 54.11,69.78 53.71,69.38 v53.71,67.99 v53.72,67.98 | v49.4,67.95 49.3,68.05 49.3,68.51 49.86,69.07 C28.1 C27.1 | C30.1 C29.1 50.07,57.85 49.73,57.51 C31.2 47.94,56.35 v47.94,56.17 | C30.1
  pour Bottom (no thermals): 15.93,7.67 16.57,8.3 21.65,8.3 22.28,7.67 22.28,1.95 15.93,1.95
  pour Top (no thermals): 15.93,7.67 16.57,8.3 21.65,8.3 22.28,7.67 22.28,1.95 15.93,1.95
  pour Top (no thermals): 50.52,69.97 50.52,68.12 50.95,68.12 50.95,70 50.55,70
  pour Top (no thermals): 50.52,62.01 50.98,62.01 50.98,63 50.52,63
  pour Top (no thermals): 54.52,62.08 54.15,62.08 54.15,62.87 54.52,62.87
  pour Top (no thermals): 55.31,62.84 55.31,63.96 54.55,63.96 54.55,63.2 54.78,62.97 54.78,62.84
  pour Top (no thermals): 55.34,64.85 55.34,65.97 54.25,65.97 54.22,65.94 54.22,64.85
  pour Top (no thermals): 48.18,65.51 48.18,64.85 49.03,64.85 49.03,65.54 48.18,65.54
  pour Top (no thermals): 54.15,69.97 54.15,67.96 54.58,67.96 54.58,69.97
+5V  (via drill 0.35, 0.77, 0.9)
  Top 0.775: R3.2 47.78,50.17 46.85,49.24 v46.85,45.77
  Top 0.8: U$1.12 44.42,3.52 44.42,20.63 43.2,21.86 D8.C 43.1,37.46 D9.C 42.54,41.5 41.62,40.58 v41.09,40.58
  Bottom 0.775: v46.85,45.77 46.85,45.75 41.69,40.58 v41.09,40.58
  Bottom 0.8: MARKER_DROPPER.2 MARKER_DROPPER.4 24.94,40.13 40.64,40.13 v41.09,40.58
  other vias: 44.56,7.65
  pour Top (no thermals): 41.2,1.83 41.2,7.67 41.84,8.3 47.17,8.3 47.81,7.67 47.81,1.83
  pour Bottom (no thermals): 41.2,1.83 41.2,7.67 41.84,8.3 47.17,8.3 47.81,7.67 47.81,1.83
  pour Top (no thermals): 50.98,51.21 48.21,51.21 46.72,49.73 46.72,47.98 51.05,47.98 51.05,51.15
+12V
  Top 0.8: POWER_INPUT.2 19.09,20.62 19.09,25.85 16.58,28.36 CLAW_CONTROL.2
+24V  (via drill 2)
  Top 0.152: 33.22,54.67 R9.2 | 30.5,71.24 D3.C
  Top 1.4: DISCHARGING.A 23.42,93.96
  Top 1.5: 30.5,71.72 30.98,71.72 D3.C | 30.96,80.07 D5.C | D7.C
  Top 1.8: R43.2 33.12,63.34
  Top 1.9: 31.1,52.55 33.22,54.67 | R9.2 33.3,55.36 30.51,58.16 | R43.2 33.22,62.87 30.51,60.16
  Top 1.905: 30.5,32.15 31.27,31.38 R20.2 27.46,25.86 120.P$2 27.46,24.86
  Top 2: D3.C 30.94,75.8 D4.C 30.96,80.07 | D3.C | D5.C D7.C | D7.C D2.C D6.C 28.41,95.27 24.72,95.27 23.42,93.96 | 31.1,52.55 31.1,34.87 30.5,34.28 D10.C 30.5,32.15 | v46.13,22.04 47.88,20.29 68.8,20.29 C20.1 69.9,21.53 69.9,47.75 C4.1 | v31.2,22.1 30.22,22.1 27.46,24.86 | 30.51,58.16 Q6.2 30.51,60.16 | 33.12,63.34 33.12,65.15 Q18.2 30.5,71.24
  Bottom 2: v46.13,22.04 46.07,22.1 v31.2,22.1
AGND  (via drill 0.35, 0.45, 0.5, 0.77, 0.8, 1.3, 1.5)  (2 unrouted)
  Top 0.152: Q3.2 36.09,42.14 v36.22,42.26 | Q2.2 39.34,41.27 v39.28,41.2 | ARMED.C 37.51,29.66 v37.62,29.55 | 36.17,32.93 v36.2,32.9 | R3.1 47.78,53.49 v47.75,53.52 | v50.02,45.27 50.02,45.28 R4.1 | C16.2 57.29,39.4 v57.29,37.58 | C19.2 55.8,25.79 v54.65,24.63 | U1.4 53.1,49.59 U1.EPAD 53.76,49.6 U1.13 | R18.1 56.04,94.53 v56.07,94.5 | U$9.P$19 48.23,66.6 45.34,66.6 v45.01,66.27 | C2.2 37.15,65.73 | R19.1 51.76,94.5 v50.16,94.5 | C2.2 37.11,65.52 | C2.2 37.32,65.42 v36.59,64.69 36.59,64.25 C3.2 | C6.1 60.33,73.93 v60.56,74.16 | C36.1 43.86,64.54 v43.45,64.54 | U2.4 64.27,64.4 v64.86,63.81
  Top 0.35: R14.1 v3.61,91.31 v3.6,91.3 | C9.2 C13.2 75.81,64.41 v75.78,64.39 | C9.2
  Top 0.4: USB_ID/USB_DP/USB_DN.GND 7.92,60.2 7.9,60.17 v7.9,59.3
  Top 0.406: USB_ID/USB_DP/USB_DN.S1 7.76,68.34 | 7.76,68.34 v7.8,68.3 | USB_ID/USB_DP/USB_DN.S2 7.76,68.34 | USB_ID/USB_DP/USB_DN.S3 7.86,59.34 v7.9,59.3 10.57,59.3 USB_ID/USB_DP/USB_DN.S4
  Top 0.775: U1.EPAD v53.43,51.51 | v53.43,51.51
  Top 0.8: Q17.2 49.89,38.74 v49.27,39.37 | v40.9,29.33 40.92,29.31 C5.2 | D10.A 36.17,32.93 | Q12.2 49.85,42.68 v49.5,43.03 | C14.2 50.7,84.8 v50.3,85.2 | VR1.1 52.4,77.1 v52.4,75.7
  Top 1.3: R17.1 3.64,93.96 v3.6,94
  Top 1.5: U$2.1 44.5,89 v44.5,90.8 | U$8.1 44.5,81.11 v44.5,82.7 | U$5.1 46.53,75.1 v47.13,75.7
  other vias: 26.73,7.67 37.01,7.67 50.95,66.44 52.57,66.42 52.57,64.8 50.95,64.79
  pour Top (no thermals): 23.55,7.67 24.19,8.3 29.27,8.3 29.9,7.67 29.9,1.95 23.55,1.95
  pour Bottom (no thermals): 23.55,7.67 24.19,8.3 29.27,8.3 29.9,7.67 29.9,1.95 23.55,1.95
  pour Top (no thermals): 33.71,1.83 40.19,1.83 40.19,7.67 39.68,8.3 34.09,8.3 33.58,7.67 33.58,1.95
  pour Bottom (no thermals): 33.58,7.67 33.58,1.95 33.71,1.83 40.06,1.83 40.06,5.76 40.19,5.89 40.19,7.67 39.68,8.3 34.09,8.3
  pour Bottom (rank 3, no thermals): 0.25,101.35 101.35,101.35 101.35,8.13 48.01,8.13 47.5,8.64 41.66,8.64 40.89,7.87 40.39,7.87 39.62,7.11 24.13,7.11 23.37,7.87 22.61,7.87 21.84,8.64 16.26,8.64 15.75,8.13 0.25,8.13
ARM_TORPEDO
  Top 0.152: U$6.P$3 33.13,18.66 35.31,20.84 35.31,27.88 36.02,28.59 37.91,28.59 40.09,30.77 40.09,42.97 43.92,46.8 43.92,48.86 44.66,49.6 44.66,55.35 49.53,60.22 U$9.P$30
COIL_1  (via drill 1.5)
  Top 1.5: D5.A 22.96,80.08 TORPEDO_CONNECTOR.7 | v35.1,80 U$8.2
  Bottom 1.3: 26.6,79.6 Q7.3 27.43,79.57 | 30,79.57 Q4.3 30.83,79.54
  Bottom 1.5: TORPEDO_CONNECTOR.7 23.21,81.54 25.15,79.6 26.6,79.6 | v35.1,80 34.64,79.54 30.83,79.54 | 30,79.57 27.43,79.57
COIL_1_GATE  (via drill 0.35)
  Top 0.152: v32.62,78.03 33.49,77.15 33.49,69.81 36.3,67 U$9.P$18
  Bottom 0.152: Q7.1 28.65,78.6 30.61,78.6 Q4.1 31.52,78.03 v32.62,78.03 | v32.62,78.03
COIL_2
  Top 1.5: D7.A 25.96,83.72 23.51,83.72 TORPEDO_CONNECTOR.8
  Bottom 1.5: TORPEDO_CONNECTOR.8 23.15,85.73 25.61,83.27 26.57,83.27 Q8.3 27.33,83.37 30.06,83.37 Q14.3 30.78,83.33 35.13,83.33 U$7.2
COIL_2_GATE  (via drill 0.35)
  Top 0.152: U$9.P$17 36.41,67.41 36.4,67.4 33.77,70.03 33.77,77.91 32.65,79.03 v32.65,81.77
  Bottom 0.152: Q8.1 28.72,82.37 30.59,82.37 Q14.1 31.6,81.86 32.55,81.86 v32.65,81.77
COIL_3  (via drill 1.5)
  Top 1.5: D3.A 25.74,72.48 22.18,72.48 TORPEDO_CONNECTOR.5 | U$5.2 38.41,75 v35.9,72.5
  Bottom 1.3: 26.74,72.24 Q9.3 27.23,72.27 | 30.18,72.27 Q5.3 30.66,72.24
  Bottom 1.5: TORPEDO_CONNECTOR.5 22.42,72.24 26.74,72.24 | 30.18,72.27 27.23,72.27 | 30.66,72.24 35.64,72.24 v35.9,72.5
COIL_3_GATE  (via drill 0.35)
  Top 0.152: v35.67,70.39 36.56,70.39 37.86,69.1 49.13,69.1 U$9.P$14
  Bottom 0.152: Q9.1 28.85,71.3 30.44,71.3 Q5.1 v35.67,70.39
COIL_4
  Top 1.5: D4.A 26.06,76.32 22.53,76.32 TORPEDO_CONNECTOR.6
  Bottom 1.3: 26.87,76.17 Q13.3 27.14,76.17 | 30.27,76.17 Q10.3 30.7,76
  Bottom 1.5: TORPEDO_CONNECTOR.6 22.92,77.35 24.09,76.17 26.87,76.17 | 30.27,76.17 27.14,76.17 | U$4.2 35.41,76 30.7,76
COIL_4_GATE  (via drill 0.35)
  Top 0.152: v35.13,65.31 35.13,67.66 32.78,70.01 v32.78,74.43 | U$9.P$27 47.62,63.4 47.32,63.1 47.32,62.42 v48.03,61.71
  Bottom 0.152: Q13.1 28.81,75.07 30.48,75.07 Q10.1 31.61,74.46 32.74,74.46 v32.78,74.43 | v35.13,65.31 35.6,64.85 35.6,62.87 36.75,61.71 v48.03,61.71 | v48.03,61.71
COIL_5
  Top 1.5: D6.A 25.44,91.6 16.3,91.6 13.1,88.4 13.1,84.4 15.96,81.54 TORPEDO_CONNECTOR.3
  Bottom 1.5: TORPEDO_CONNECTOR.3 15.97,81.54 13.04,84.48 13.04,88.29 16.35,91.6 Q15.3 Q11.3 30.5,91.7 35.6,91.7 U$3.2
COIL_5_GATE  (via drill 0.35)
  Top 0.152: U$9.P$15 36.6,68.2 34.43,70.37 34.43,78.62 33.65,79.4 33.65,89.43 v32.88,90.19
  Bottom 0.152: Q15.1 28.85,90.4 30.45,90.4 Q11.1 32.04,90.19 v32.88,90.19
COIL_S  (via drill 1.5)
  Top 1.5: D2.A 25.85,87.8 25,87.8 23.2,89.6 19.85,89.6 TORPEDO_CONNECTOR.4 | v35.1,87.8 38.3,87.8 U$2.2
  Bottom 1.3: 30.17,87.6 30.37,87.8 Q1.3 30.63,87.57
  Bottom 1.4: 26.64,87.44 Q16.3 27.1,87.8 27.3,87.6
  Bottom 1.5: 26.64,87.44 25.3,87.44 23.15,89.58 19.84,89.58 TORPEDO_CONNECTOR.4 | 30.17,87.6 27.3,87.6 | 30.63,87.57 34.87,87.57 v35.1,87.8
COIL_S_GATE  (via drill 0.35)
  Top 0.152: U$9.P$16 36.5,67.8 34.09,70.21 34.09,78.55 33.37,79.28 33.37,85.55 v32.78,86.13
  Bottom 0.152: Q16.1 28.85,86.6 30.45,86.6 Q1.1 31.78,86.13 v32.78,86.13
DROPPER1  (via drill 0.8)
  Top 0.8: Q17.3 51.54,36.54 51.4,36.4 49.9,36.4 48.94,37.36 D8.A 47.56,37.4 45.7,37.4 v45.5,37.2
  Bottom 0.8: v45.5,37.2 44.97,37.2 44.08,38.09 23.49,38.09 22.52,37.11 18.25,37.11 MARKER_DROPPER.1
DROPPER1_GATE
  Top 0.152: Q17.1 52.49,41.34 51.69,42.15 51.69,43.02 50.73,43.97 46.87,43.97 44.2,46.64 44.2,48.74 44.94,49.48 44.94,55.17 49.93,60.16 U$9.P$31
DROPPER2  (via drill 0.8)
  Top 0.8: Q12.3 49.72,40.58 48.8,41.5 D9.A 45.5,39.51 v45.5,38.8
  Bottom 0.8: v45.5,38.8 44.74,38.8 44.43,39.11 MARKER_DROPPER.3
DROPPER2_GATE
  Top 0.152: Q12.1 50.84,44.34 46.94,44.34 44.55,46.73 | 44.55,46.73 44.5,46.77 | U$9.P$32 50.33,60.16 45.22,55.05 45.22,49.37 44.53,48.67 44.53,48.09 44.55,48.07 44.55,46.73
LED1
  Top 0.152: U$9.P$6 52.35,73.63 55.05,76.33 55.05,89.08 LIGHT1.A
LED2
  Top 0.152: U$9.P$7 51.94,73.61 54.76,76.43 54.76,86.58 LIGHT2.A
N$2
  Top 0.152: Y2.2 40.66,63.39 R5.2 39.07,63.5 C3.1
N$3
  Top 0.152: R5.1 42.36,64.69 42.92,65.25 46.6,65.25 47.16,65.81 U$9.P$21
N$4
  Top 0.35: CHARGING.C R14.2
N$6
  Top 0.152: USB_ID/USB_DP/USB_DN.ID 11.92,63.04
  Top 0.35: 11.92,63.04 R11.1
N$7
  Top 0.152: USB_ID/USB_DP/USB_DN.D+ R1.1
N$8
  Top 0.152: USB_ID/USB_DP/USB_DN.D- 12.91,64.64 13.58,65.31 R13.1
N$10
  Top 0.152: R20.1 ARMED.A
N$11
  Top 0.152: U$9.P$20 47.16,66.2 46.49,65.53 39.22,65.53 C2.1 39.02,66.13 38.58,66.57 36.49,66.57 35.86,65.94 35.86,63.1 Y2.1
N$12
  Top 0.152: U$9.P$47 56.21,64.6 R6.2
N$15
  Top 1.3: R17.2 DISCHARGING.C
N$16
  Top 0.152: R18.2 54.59,92.58 LIGHT1.C
N$17
  Top 0.152: R19.2 LIGHT2.C
N$18
  Top 0.152: R10.1 62.54,73.6 USB_BOOT.1
N$26
  Top 1.5: C5.1 41.12,24.45
  Top 2: 41.12,24.45 41.12,19.23 U$6.P$6 | 120.P$1 40.25,25.33 C5.1
N$29
  Top 0.152: R7.2 56.55,62.83 56.55,63.5 55.86,64.19 55.69,64.19 55.67,64.21 U$9.P$46
N$33  (via drill 0.35)
  Top 0.152: v30.6,64.4 30.44,64.23 30.44,64.11 30.44,63.28 Q18.1 | v34.8,64.33 35.12,64.01 35.12,63.44 R43.1 34.92,58.55 36.38,57.1 R44.2
  Bottom 0.152: v34.8,64.33 34.8,64.47 34.53,64.73 30.93,64.73 v30.6,64.4
N$34
  Top 0.152: R44.1 41.59,52.86 41.59,46.06 39.72,44.19 Q2.3
N$35  (via drill 0.35)
  Top 0.152: R12.2 36.62,54.19 35.48,54.19 R9.1 35.27,54.94 35.27,55.8 v34.97,56.1 | v30.27,56.03 30.1,55.87 30.1,55.32 Q6.1
  Bottom 0.152: v34.97,56.1 30.34,56.1 v30.27,56.03
N$36
  Top 0.152: R12.1 39.67,54.07 41.23,52.51 41.23,46.13 40.09,44.99 37.94,44.99 36.83,43.88 34.31,43.88 Q3.3
N$45
  Top 0.152: U1.8 50.62,47 49.74,47 49.56,47.18 R4.2
N$46
  Top 0.152: U1.14 57.64,50.23 58.48,49.39 58.48,44.02 57.27,42.8 C17.2
N$47
  Top 0.152: U1.9 55.71,46.99 54.67,45.95 54.67,43.63 55.56,42.74 C17.1 C16.1 55.65,39.34 55.65,32.69 C19.1
N$48
  Top 0.152: U1.11 56.97,48.29 57.45,47.81 57.45,46.59 55.49,44.63 55.49,44.38 C18.2
N$49
  Top 0.152: U1.12 57.15,48.93 57.95,48.12 57.95,45 C18.1
PWM_CLAW  (via drill 0.35)
  Top 0.152: v28.31,45.8 28.31,30.87 21.69,24.26 CLAW_CONTROL.4 | U$9.P$34 51.13,60.53 45.5,54.9 45.5,48.64 v45.24,48.38
  Bottom 0.152: v28.31,45.8 28.31,47.17 30.27,49.14 44.48,49.14 v45.24,48.38
PWM_DRIVER1  (via drill 0.35)
  Top 0.152: U$9.P$35 51.54,53.69 v50.39,52.53 | v49.24,50.22 49.38,50.22 50.61,50.22 U1.3
  Bottom 0.152: v50.39,52.53 49.94,52.53 48.91,51.51 48.91,50.55 v49.24,50.22
PWM_DRIVER2
  Top 0.152: U1.16 56.23,52.47 55.94,52.77 52.17,52.77 51.94,52.99 U$9.P$36
PWM_OUT1  (via drill 0.35)
  Top 0.152: U1.7 50.83,47.43 53.03,47.43 53.28,47.18 53.28,37.04 47.22,30.97 47.22,30.58 v46.59,29.95
  Bottom 0.152: v46.59,29.95 45.98,29.95 45.59,30.34 23.64,30.34 21.69,28.4 CLAW_CONTROL.5
PWM_OUT2  (via drill 0.35)
  Top 0.152: U1.10 56.02,47.43 53.85,47.43 53.59,47.16 53.59,36.92 48.21,31.54 48.21,30.94 v47.98,30.71
  Bottom 0.152: CLAW_CONTROL.6 21.76,32.55 23.63,30.68 47.95,30.68 v47.98,30.71
QSPI_SCLK
  Top 0.152: U2.6 71.65,65.67 70.73,64.75 70.73,63.63 70.54,63.44 66.23,63.44 64.78,64.89 63.45,64.89 61.74,66.61 U$9.P$52
QSPI_SD0
  Top 0.152: U2.5 72.05,64.47 72.51,64.47 73,64.96 73,67 72.5,67.51 71.36,67.51 70.39,66.54 70.39,64.15 70.09,63.85 66.21,63.85 66.05,64.02 64.88,65.18 64.69,65.18 64.68,65.17 63.57,65.17 61.73,67.01 U$9.P$53
QSPI_SD1
  Top 0.152: U2.2 63.26,67.81 U$9.P$55
QSPI_SD2
  Top 0.152: U$9.P$54 62.36,67.41 64.1,65.67 U2.3
QSPI_SD3
  Top 0.152: 55.51,66.21 61.25,66.21 64.36,63.1 70.99,63.1 71.27,63.38 71.27,64.73 71.65,65.11 72.51,65.11 72.7,65.31 72.7,66.22 U2.7 | 55.51,66.21 | 55.51,66.21 U$9.P$51
QSPI_SS
  Top 0.152: U$9.P$56 61.9,68.21 62.76,69.08 R8.1 63.73,68.21 U2.1 64.33,68.41 64.33,69.44 R10.2 C6.2 | C6.2
RESET  (via drill 0.35)
  Top 0.152: v29.06,50.98 28.54,50.98 27.33,49.77 22.29,49.77 JTAG_HEADER.15 | U$9.P$26 47.62,63.8 46.99,63.17 46.99,59.53 v45.79,58.33 v45.78,58.34 43.8,56.36 43.8,52.67 v43.37,52.24 | RESET_SWITCH.3 36.81,48.7 R27.1 | C36.2 44.54,61.68 v45.4,60.82
  Bottom 0.152: v29.06,50.98 30.02,50.02 38.14,50.02 RESET_SWITCH.3 40.09,51.97 42.3,51.97 42.56,52.24 v43.37,52.24 | v45.79,58.33 45.79,60.44 v45.4,60.82
SCL
  Top 0.152: U$1.31 80.08,7.82 77.84,10.06 77.84,72.42 72.6,77.67 61.46,77.67 53.55,69.76 U$9.P$3
SDA
  Top 0.152: U$9.P$2 53.95,69.73 61.59,77.37 72.45,77.37 77.54,72.27 U$1.32
SWD_CLK  (via drill 0.35)
  Top 0.152: JTAG_HEADER.9 15.23,46.73 22.03,46.73 22.04,46.73 26.23,46.73 28.29,48.78 28.29,49.22 29.02,49.94 | U$9.P$24 47.43,64.6 46.33,63.51 46.33,60.29 43.23,57.2 43.23,53.49 42.33,52.59 42.33,51.21 v43.37,50.17 | 29.02,49.95 29.02,49.94 | 29.02,49.94 v29.05,49.97
  Bottom 0.152: v43.37,50.17 43.37,49.92 43.18,49.72 29.36,49.72 29.11,49.97 v29.05,49.97
SWD_IO  (via drill 0.35)
  Top 0.152: v29,48.92 26.41,46.33 14.89,46.33 14.49,46.73 12.69,46.73 JTAG_HEADER.7 | U$9.P$25 47.52,64.2 46.66,63.34 46.66,60.2 43.51,57.05 43.52,57.04 43.52,53.39 42.62,52.49 42.62,51.97 v43.37,51.22
  Bottom 0.152: v43.37,51.22 44.33,50.26 44.33,49.84 43.92,49.43 29.51,49.43 v29,48.92
TORPEDO1
  Top 1.5: TORPEDO_CONNECTOR.1 23.2,65.94 Q18.3
TORPEDO1_GATE
  Top 0.152: Q2.1 38.8,43.44 39.39,43.44 43.37,47.41 43.37,49.09 44.1,49.83 44.1,55.61 48.76,60.27 48.76,62.09 48.24,62.61 U$9.P$28
TORPEDO2
  Top 1.5: Q6.3 23.21,57.25 18.1,62.36 18.1,68.08 15.99,70.19 13.74,70.19 12.52,71.41 12.52,75.37 14.5,77.35 TORPEDO_CONNECTOR.2
TORPEDO2_GATE
  Top 0.152: Q3.1 33.87,41.27 38.19,41.27 38.37,41.45 38.37,42.57 38.9,43.09 39.59,43.09 39.62,43.12 43.61,47.23 43.64,47.27 43.64,48.98 44.38,49.71 44.38,55.5 49.11,60.22 49.11,62.08 U$9.P$29
USB_DN  (via drill 0.35)
  Top 0.152: R13.2 15.34,65.87 v16.14,65.07 | v60.41,65.46 60.41,64.94 R7.1
  Bottom 0.152: v16.14,65.07 16.43,65.07 19.35,67.99 37.94,67.99 42.6,72.64 57.69,72.64 60.24,70.08 60.24,65.63 v60.41,65.46
USB_DP  (via drill 0.35)
  Top 0.152: R1.2 15.31,63.8 16.11,63.8 v16.37,64.06 | v59.38,65.43 58.91,64.96 R6.1
  Bottom 0.152: v16.37,64.06 16.53,64.23 16.53,64.43 16.86,64.76 16.86,65.09 19.47,67.69 38.17,67.69 42.83,72.35 57.54,72.35 59.94,69.95 59.94,66.06 59.38,65.5 v59.38,65.43
USB_ID
  Top 0.35: R11.2 R2.1
V+
  Top 1.5: U$6.P$2 30.4,18.5 28.83,16.93 22.31,16.93 POWER_INPUT.4
VBUS  (via drill 0.9)
  Top 0.35: 10.6,65.5 USB_ID/USB_DP/USB_DN.VBUS
  Top 0.8: v51.2,81.6 52.3,81.6 VR1.3 53,84.25 C14.1 | v13.4,68.3 13.4,67.94 12.09,66.62 11.73,66.62 10.6,65.5
  Bottom 0.8: v13.4,68.3 13.79,68.69 37.34,68.69 50.24,81.6 v51.2,81.6

### Text on the board
tPlace: Illustrated By: Isabella Richardson, 2021 | The Underwater Robotics / Team Center for / Automotive Research | Actuator Board
tNames: Microcontroller Debug